# EAGLE schematic PCB Design 2 v94 (EAGLE 9.7.0)
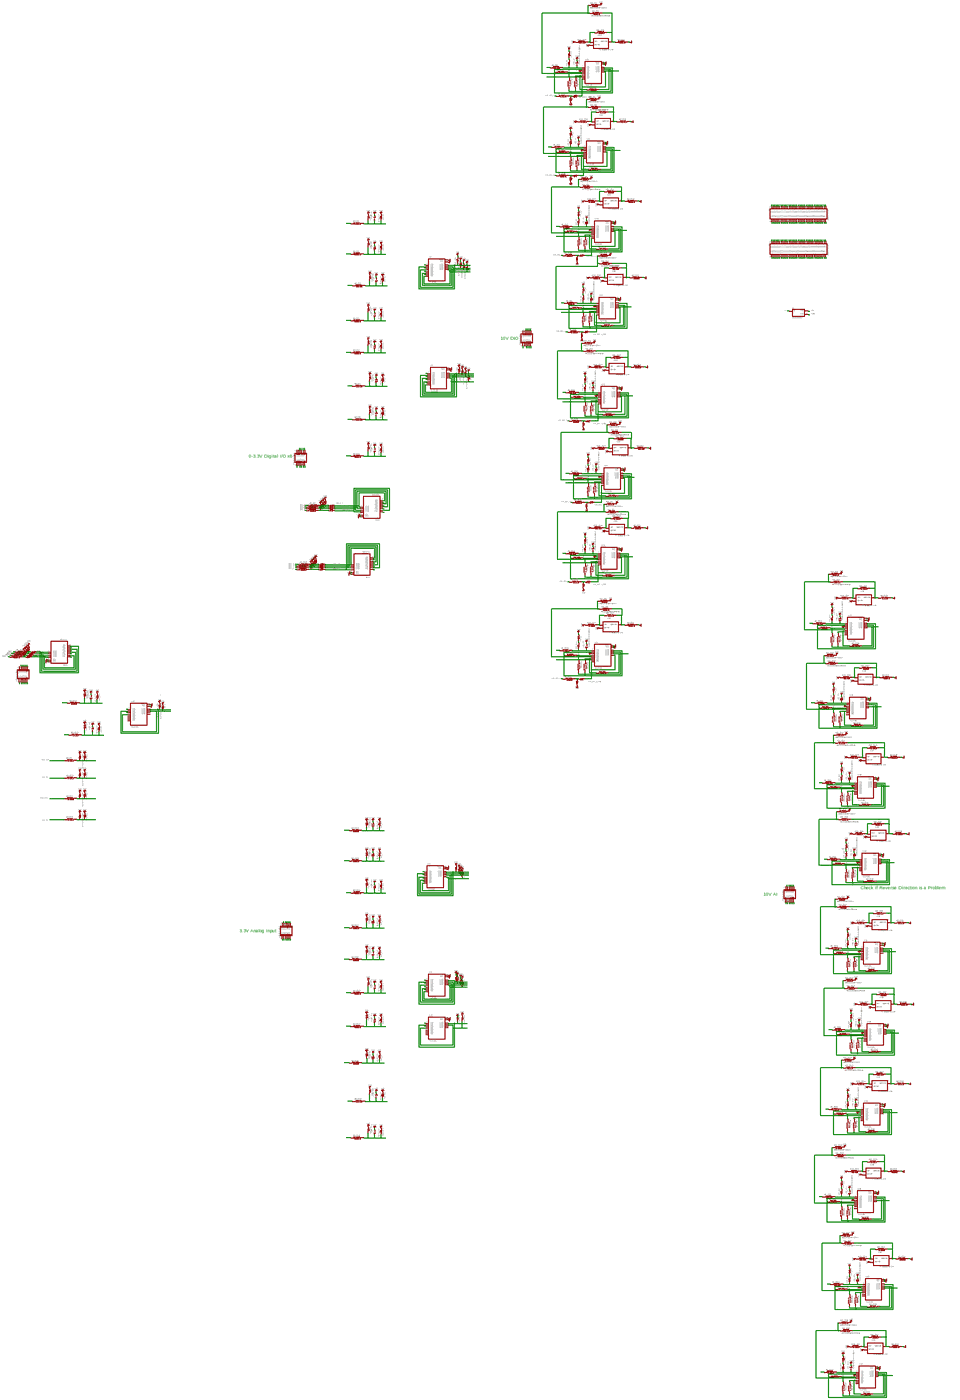
[diagram p0: schematic, sheet 1, overview]
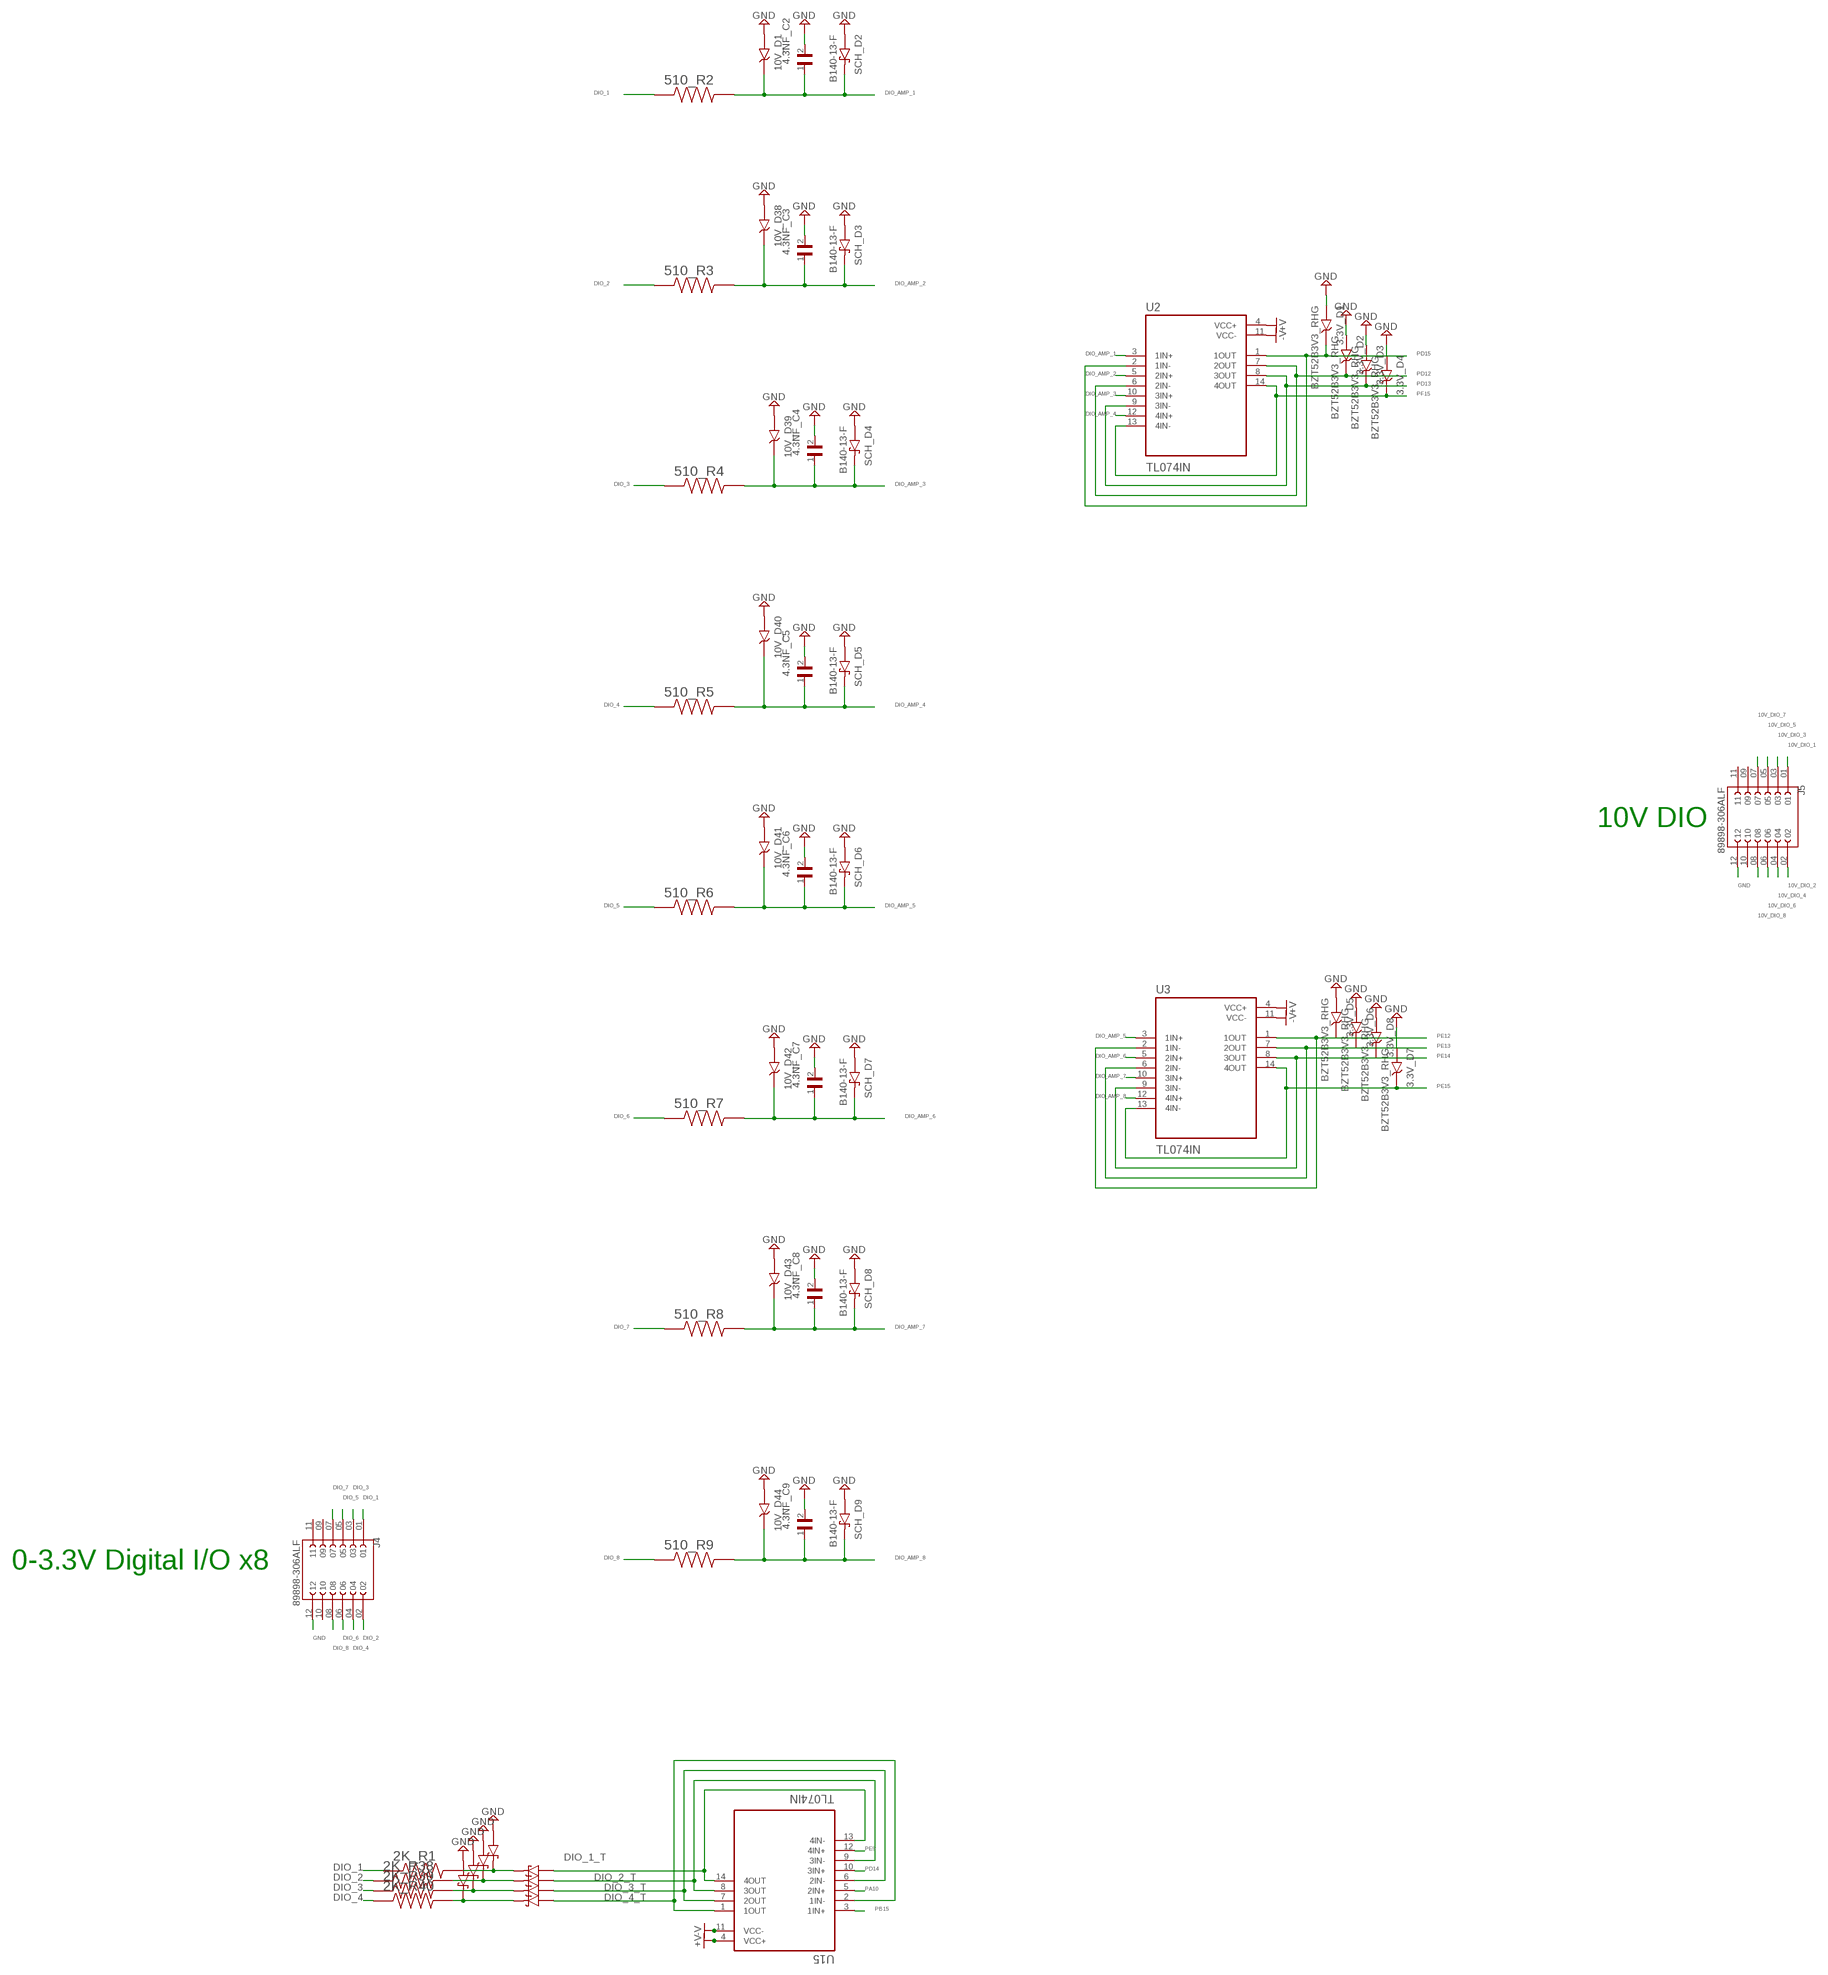
[diagram p1: schematic, sheet 1, part 1 of 7]
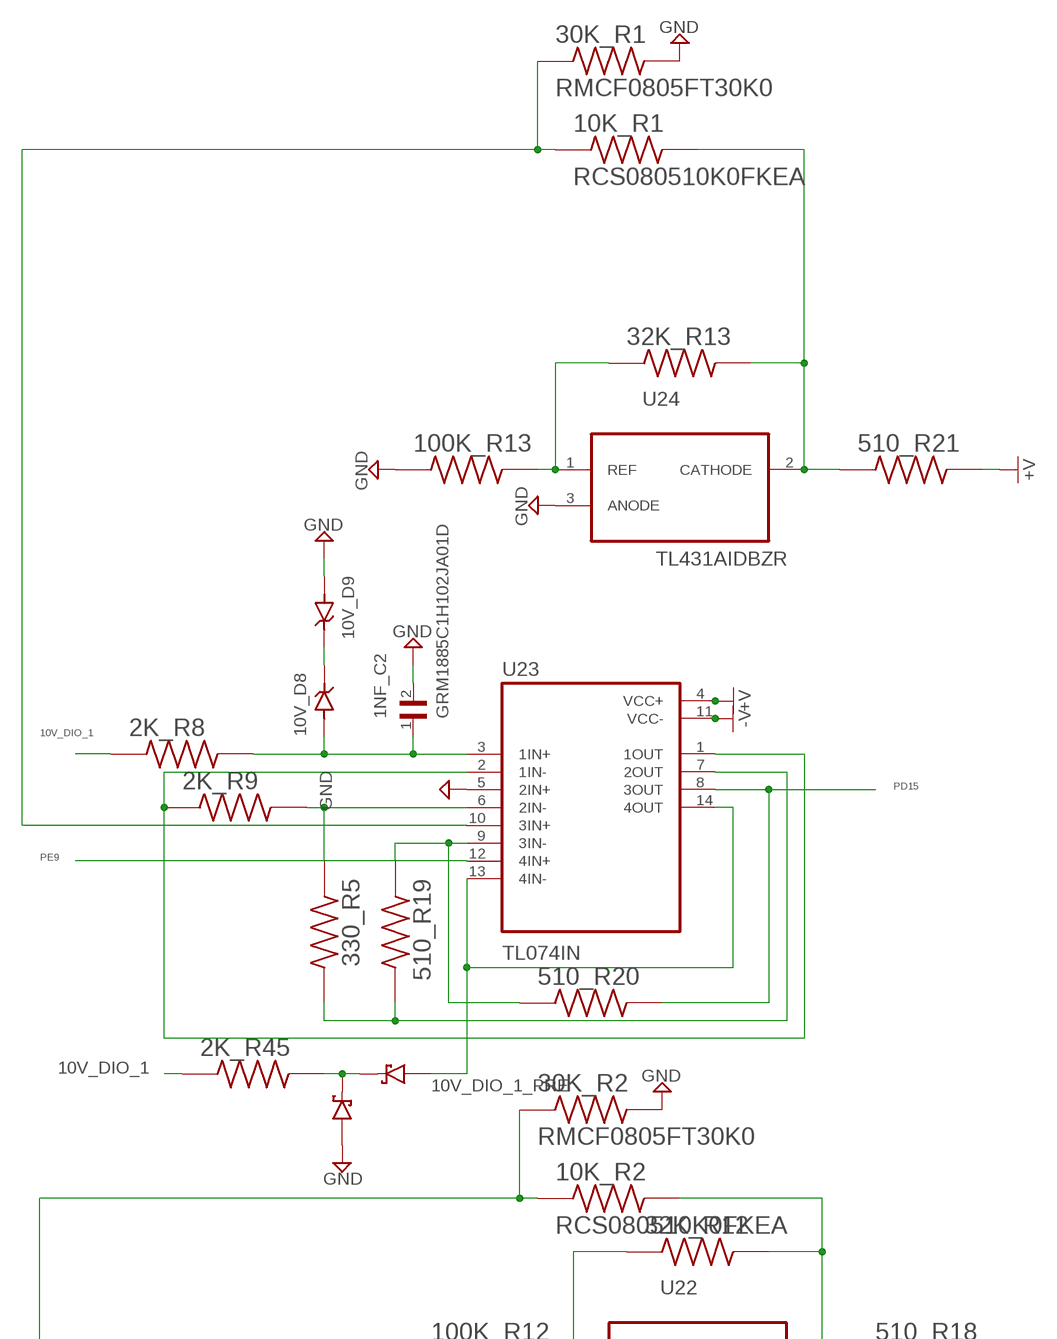
[diagram p2: schematic, sheet 1, part 2 of 7]
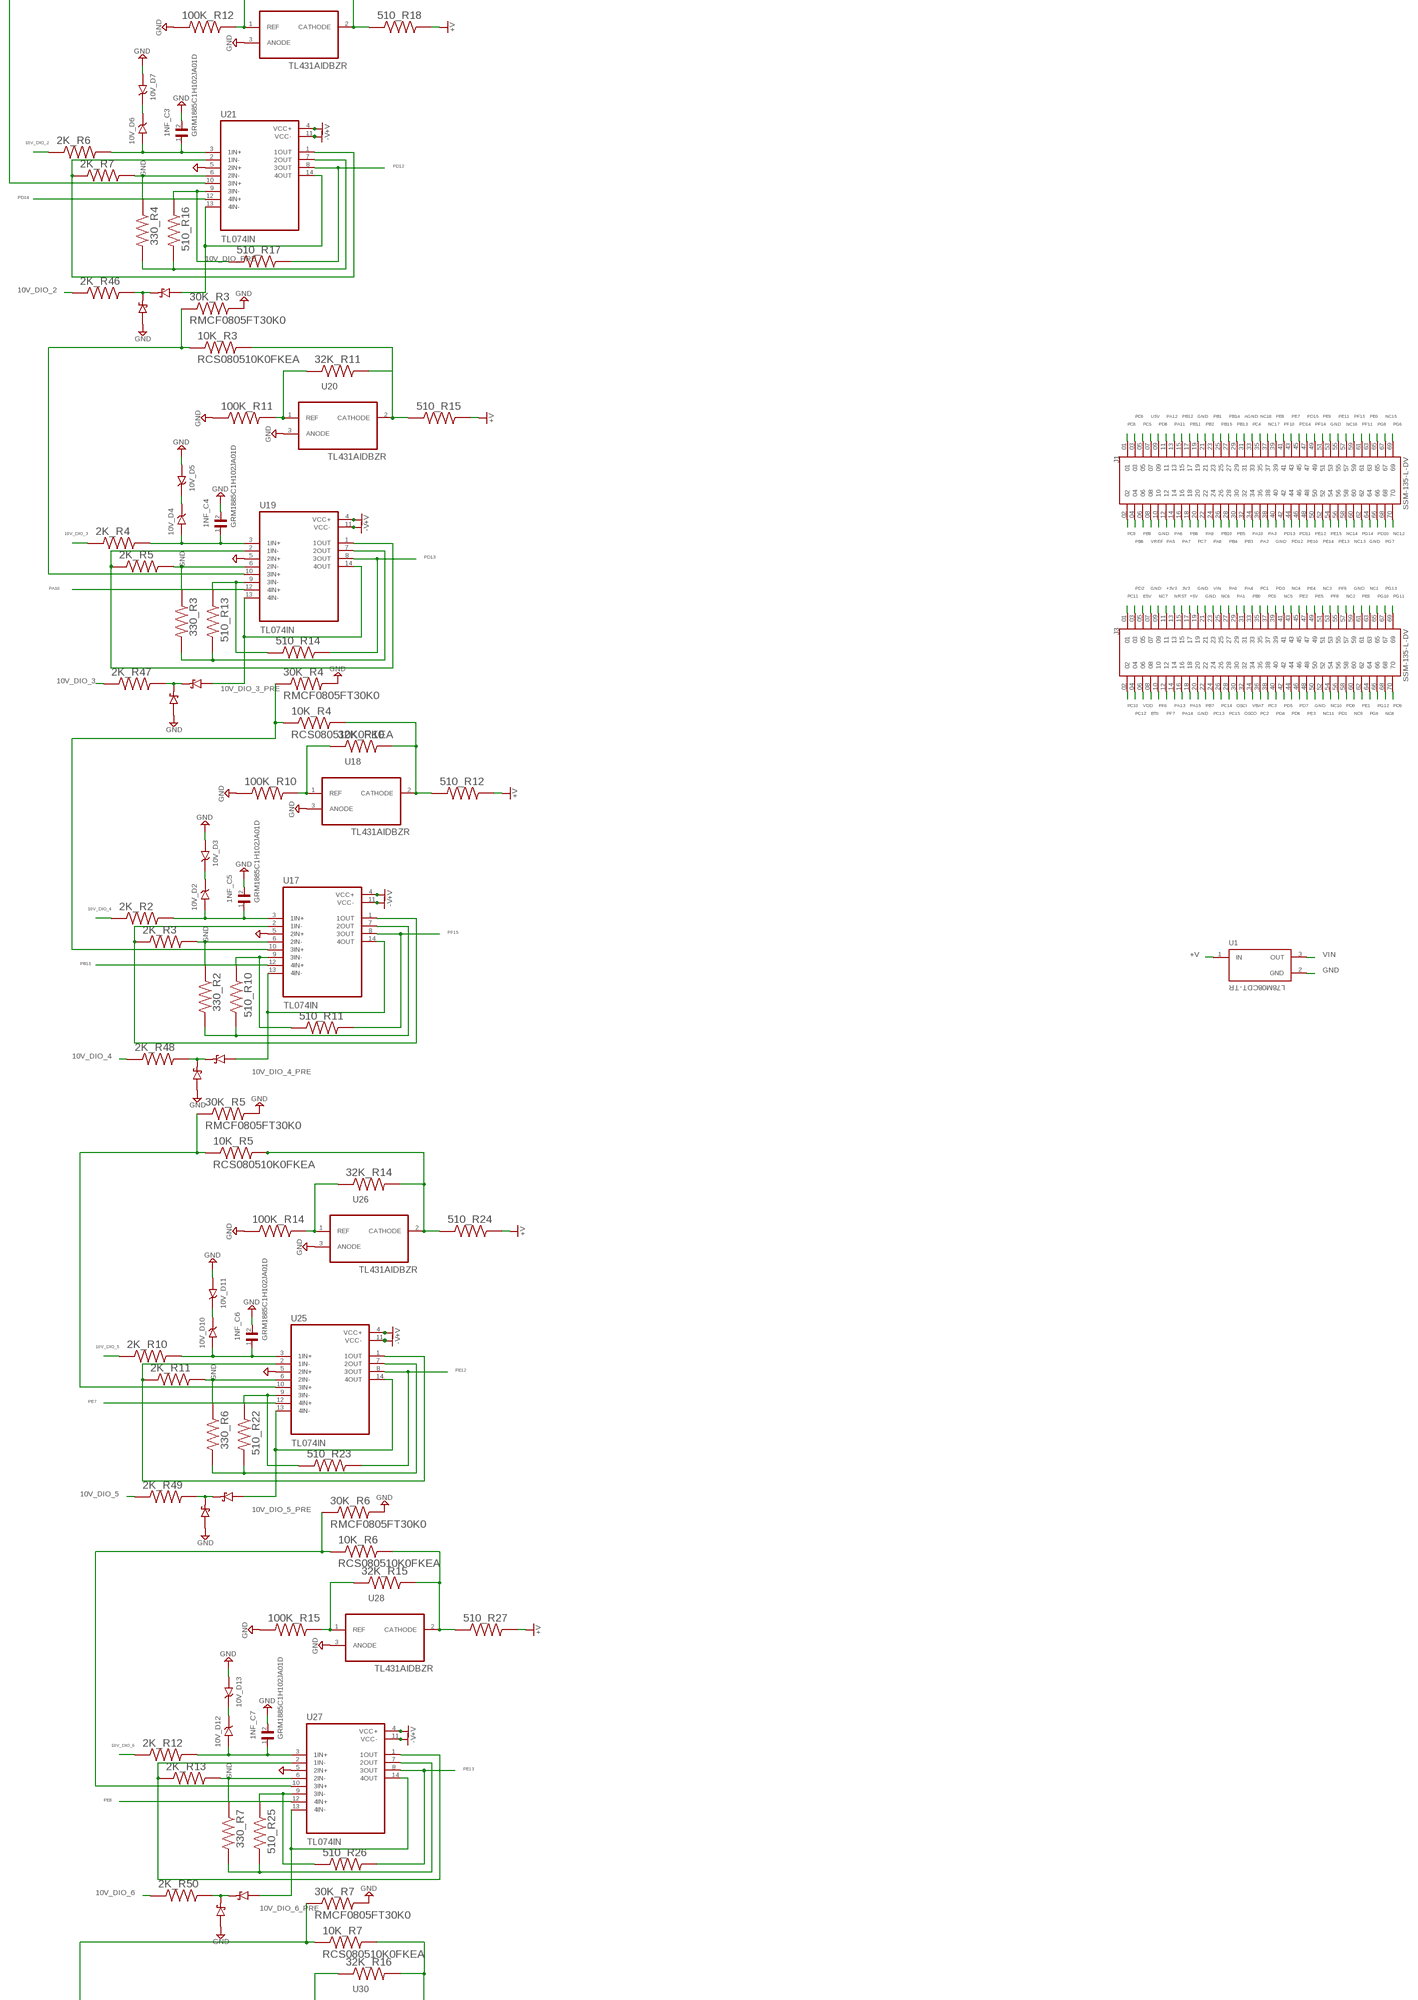
[diagram p3: schematic, sheet 1, part 3 of 7]
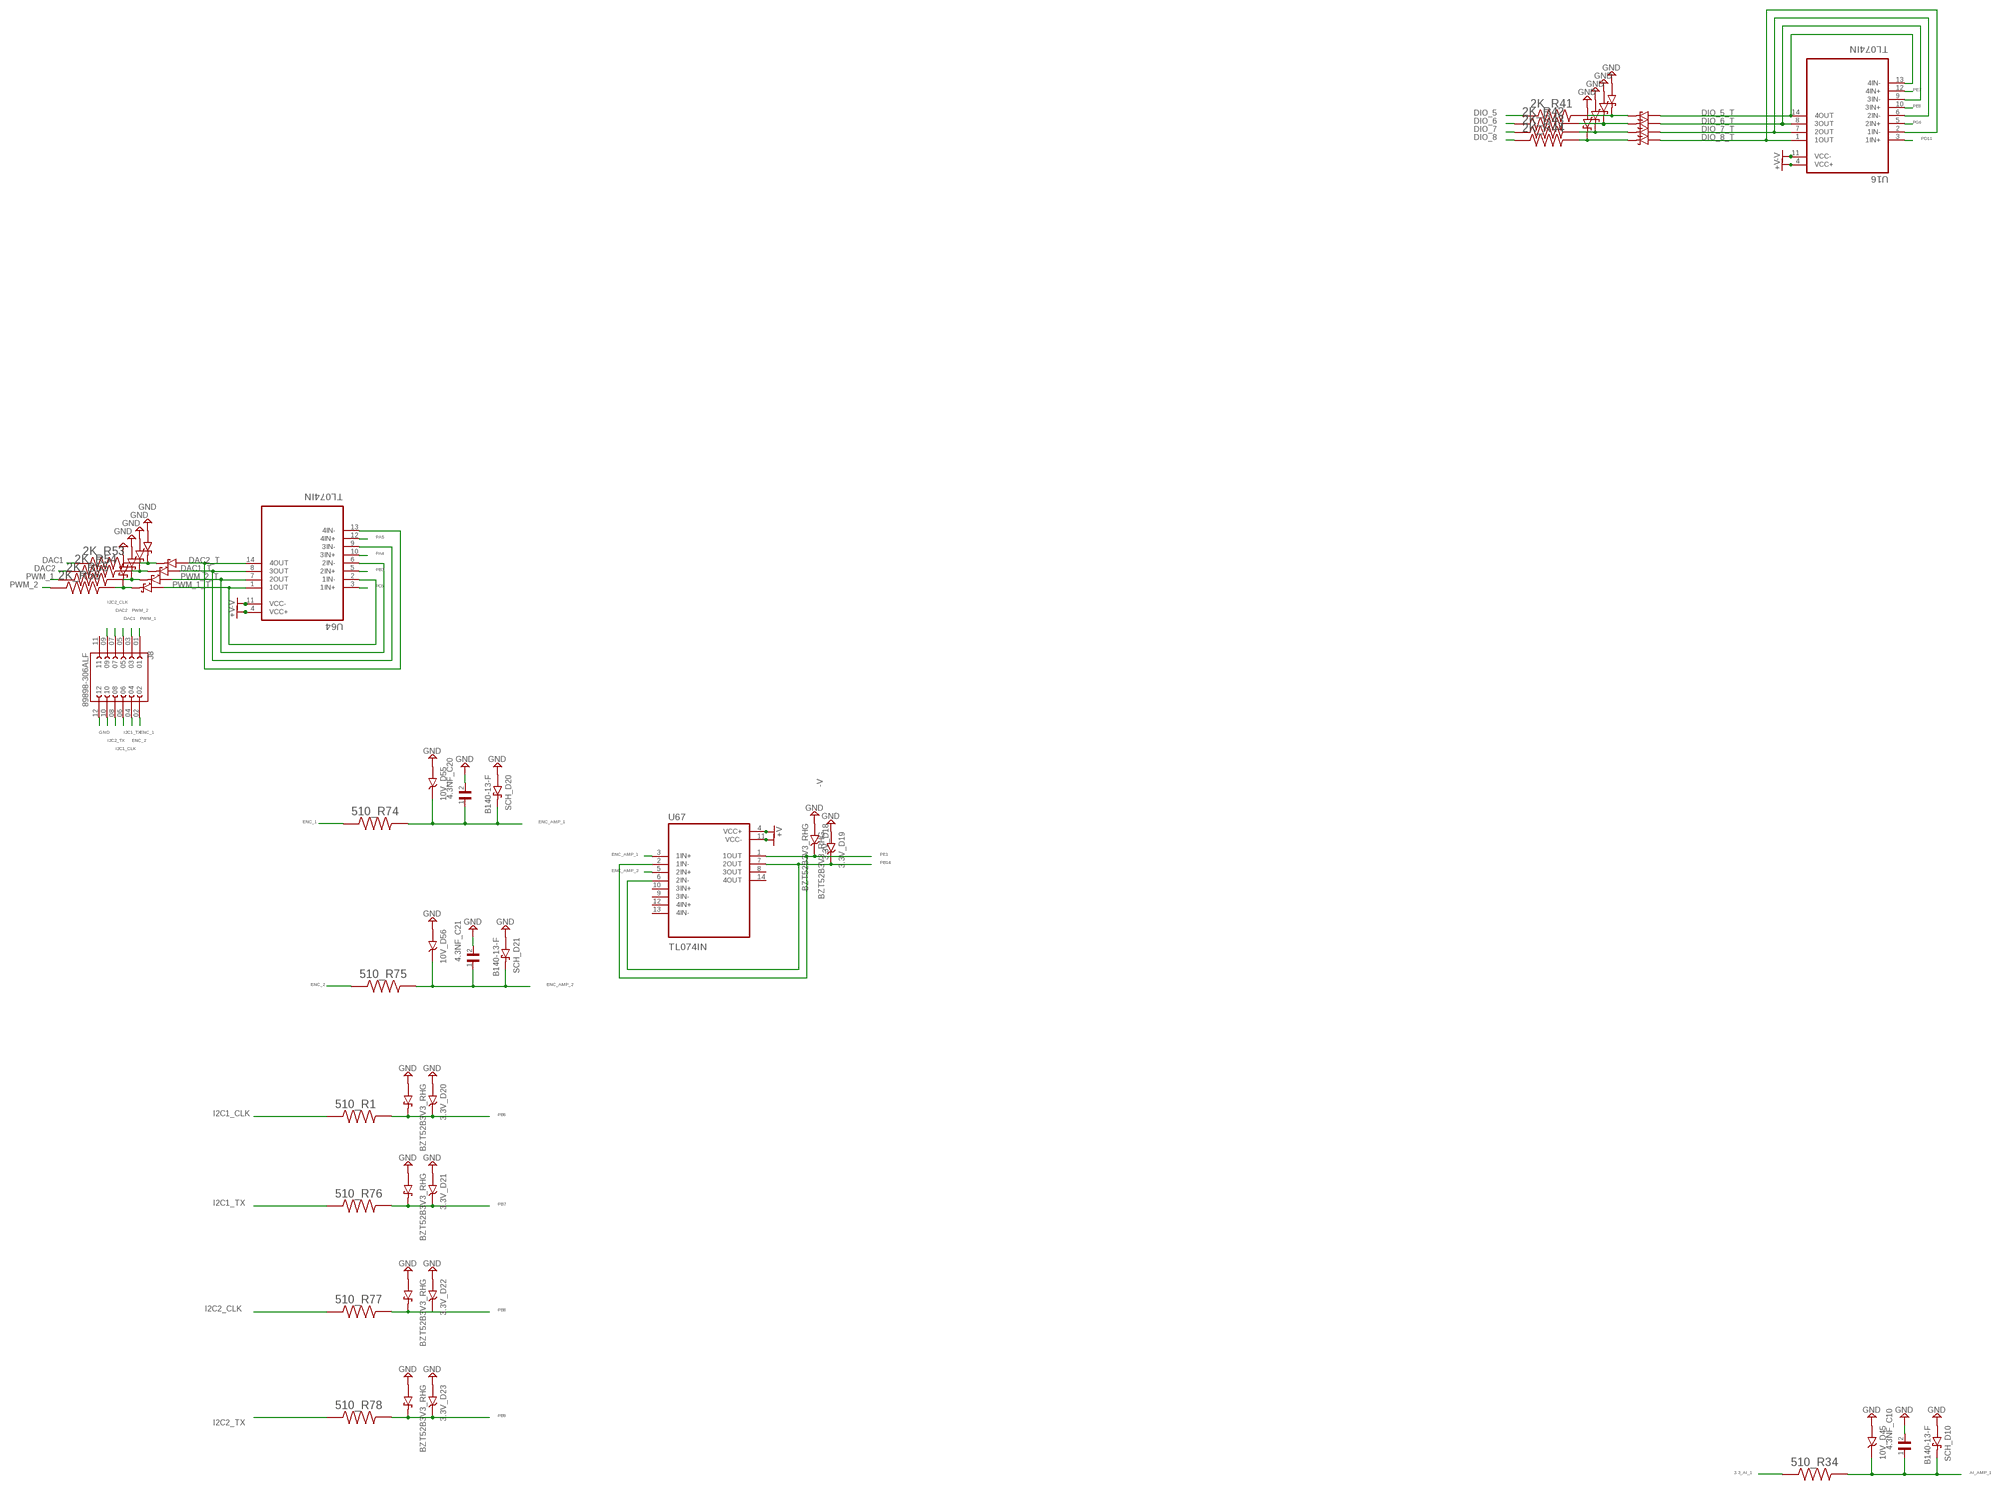
[diagram p4: schematic, sheet 1, part 4 of 7]
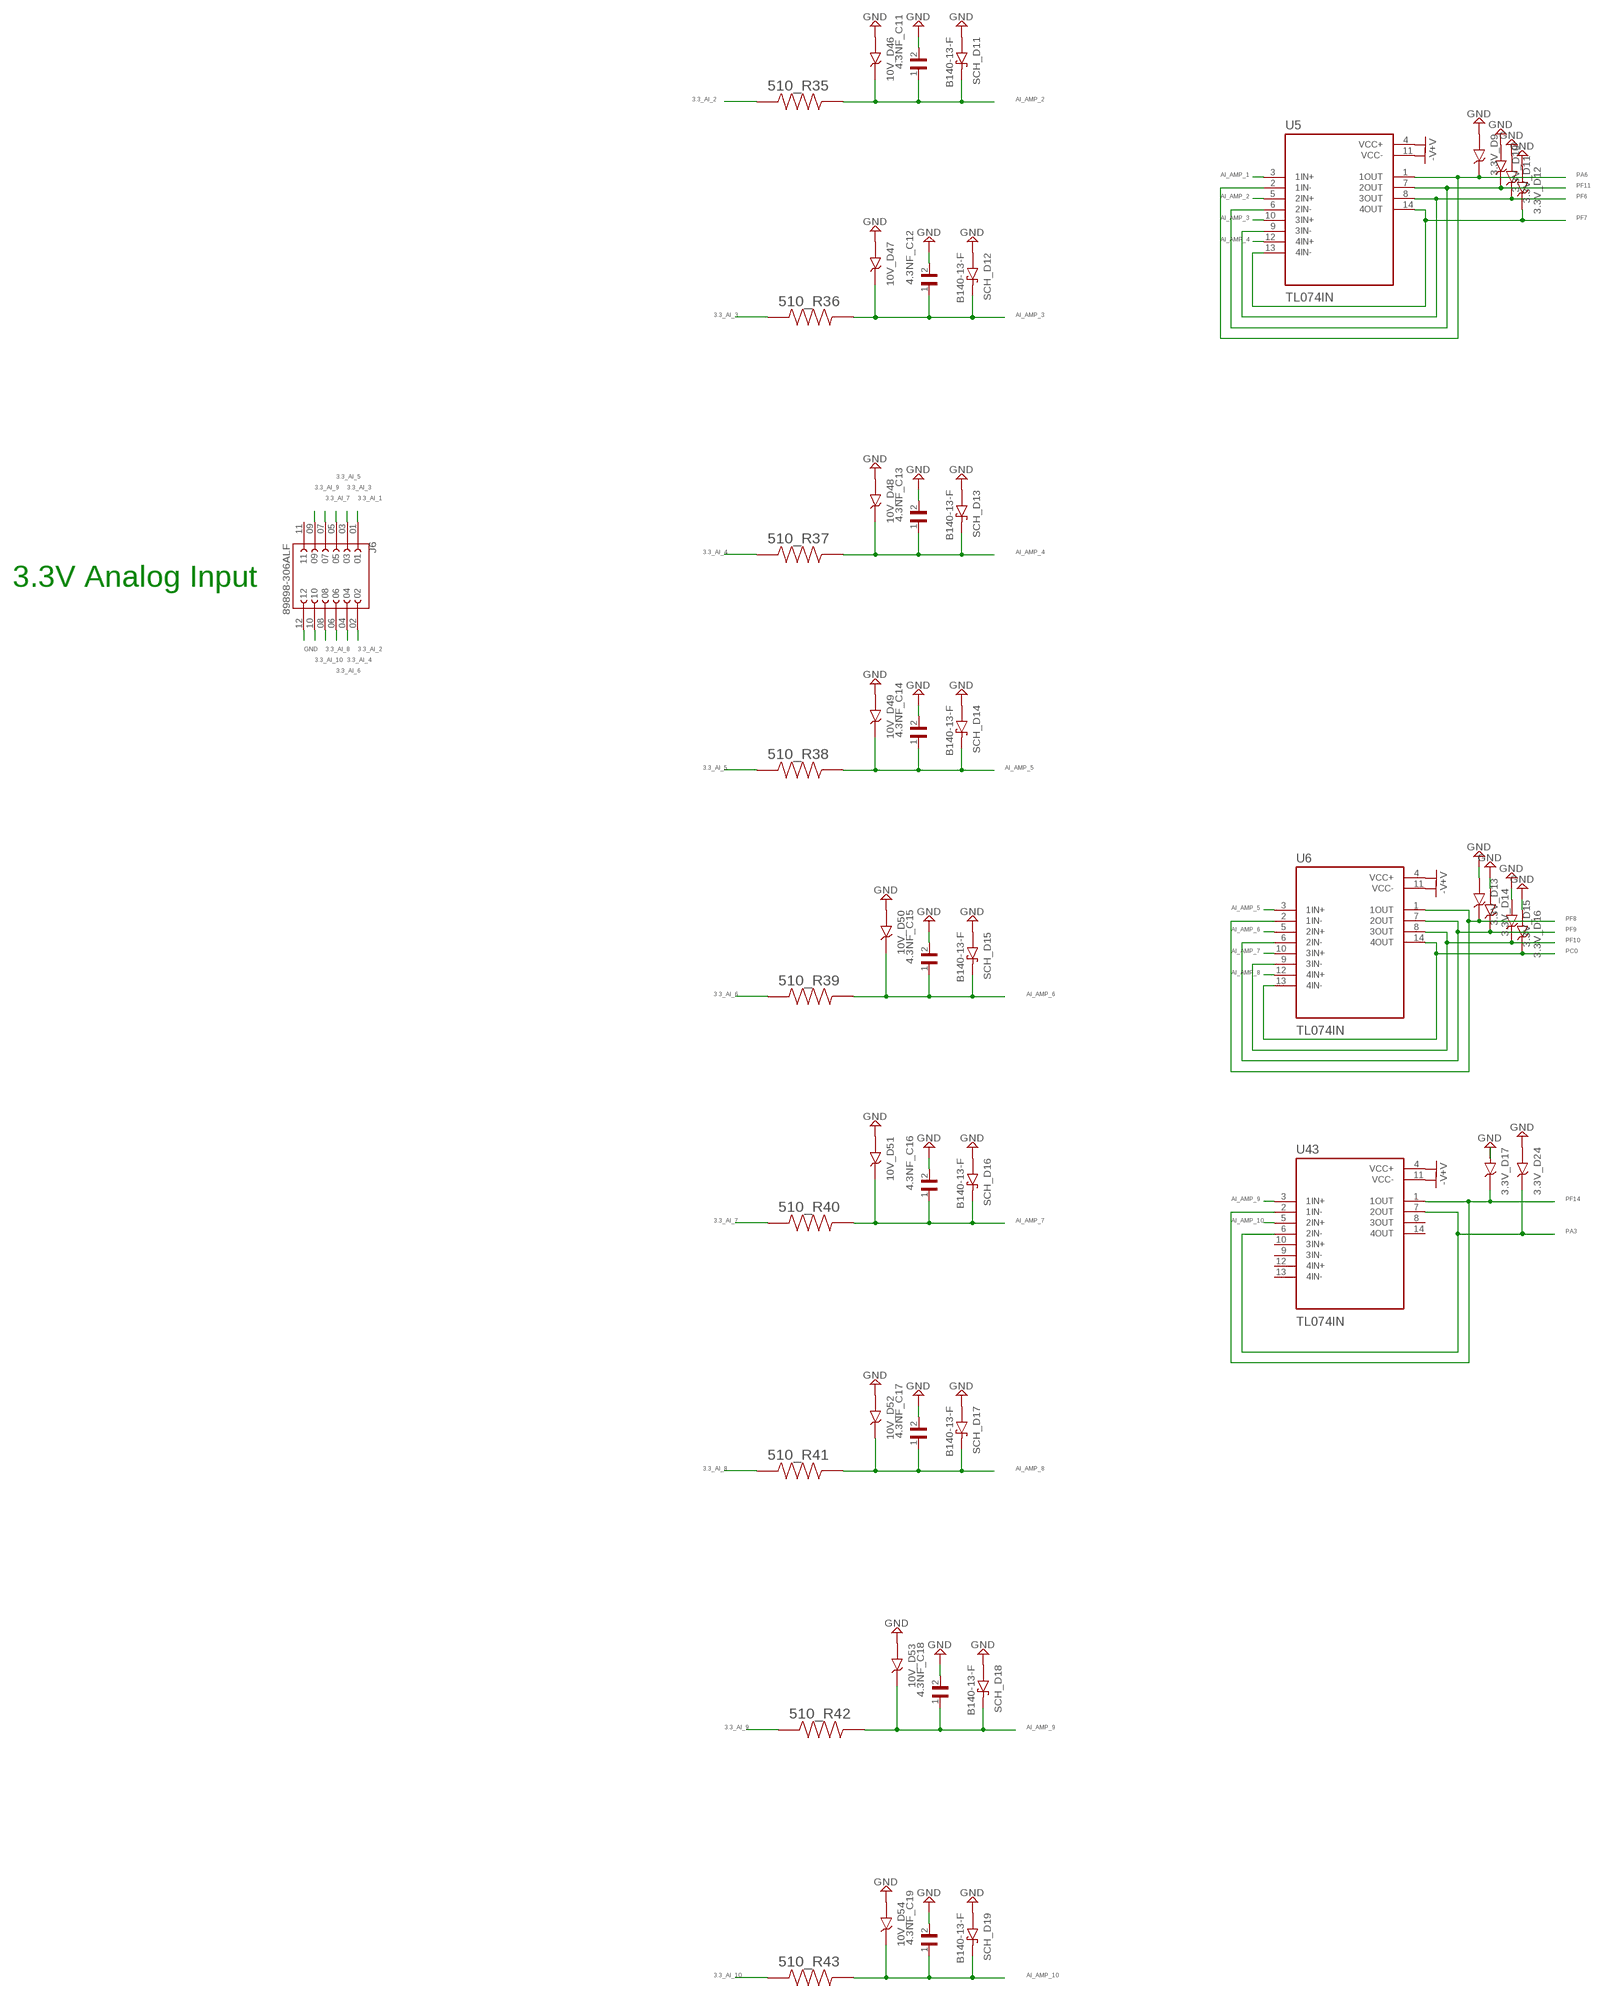
[diagram p5: schematic, sheet 1, part 5 of 7]
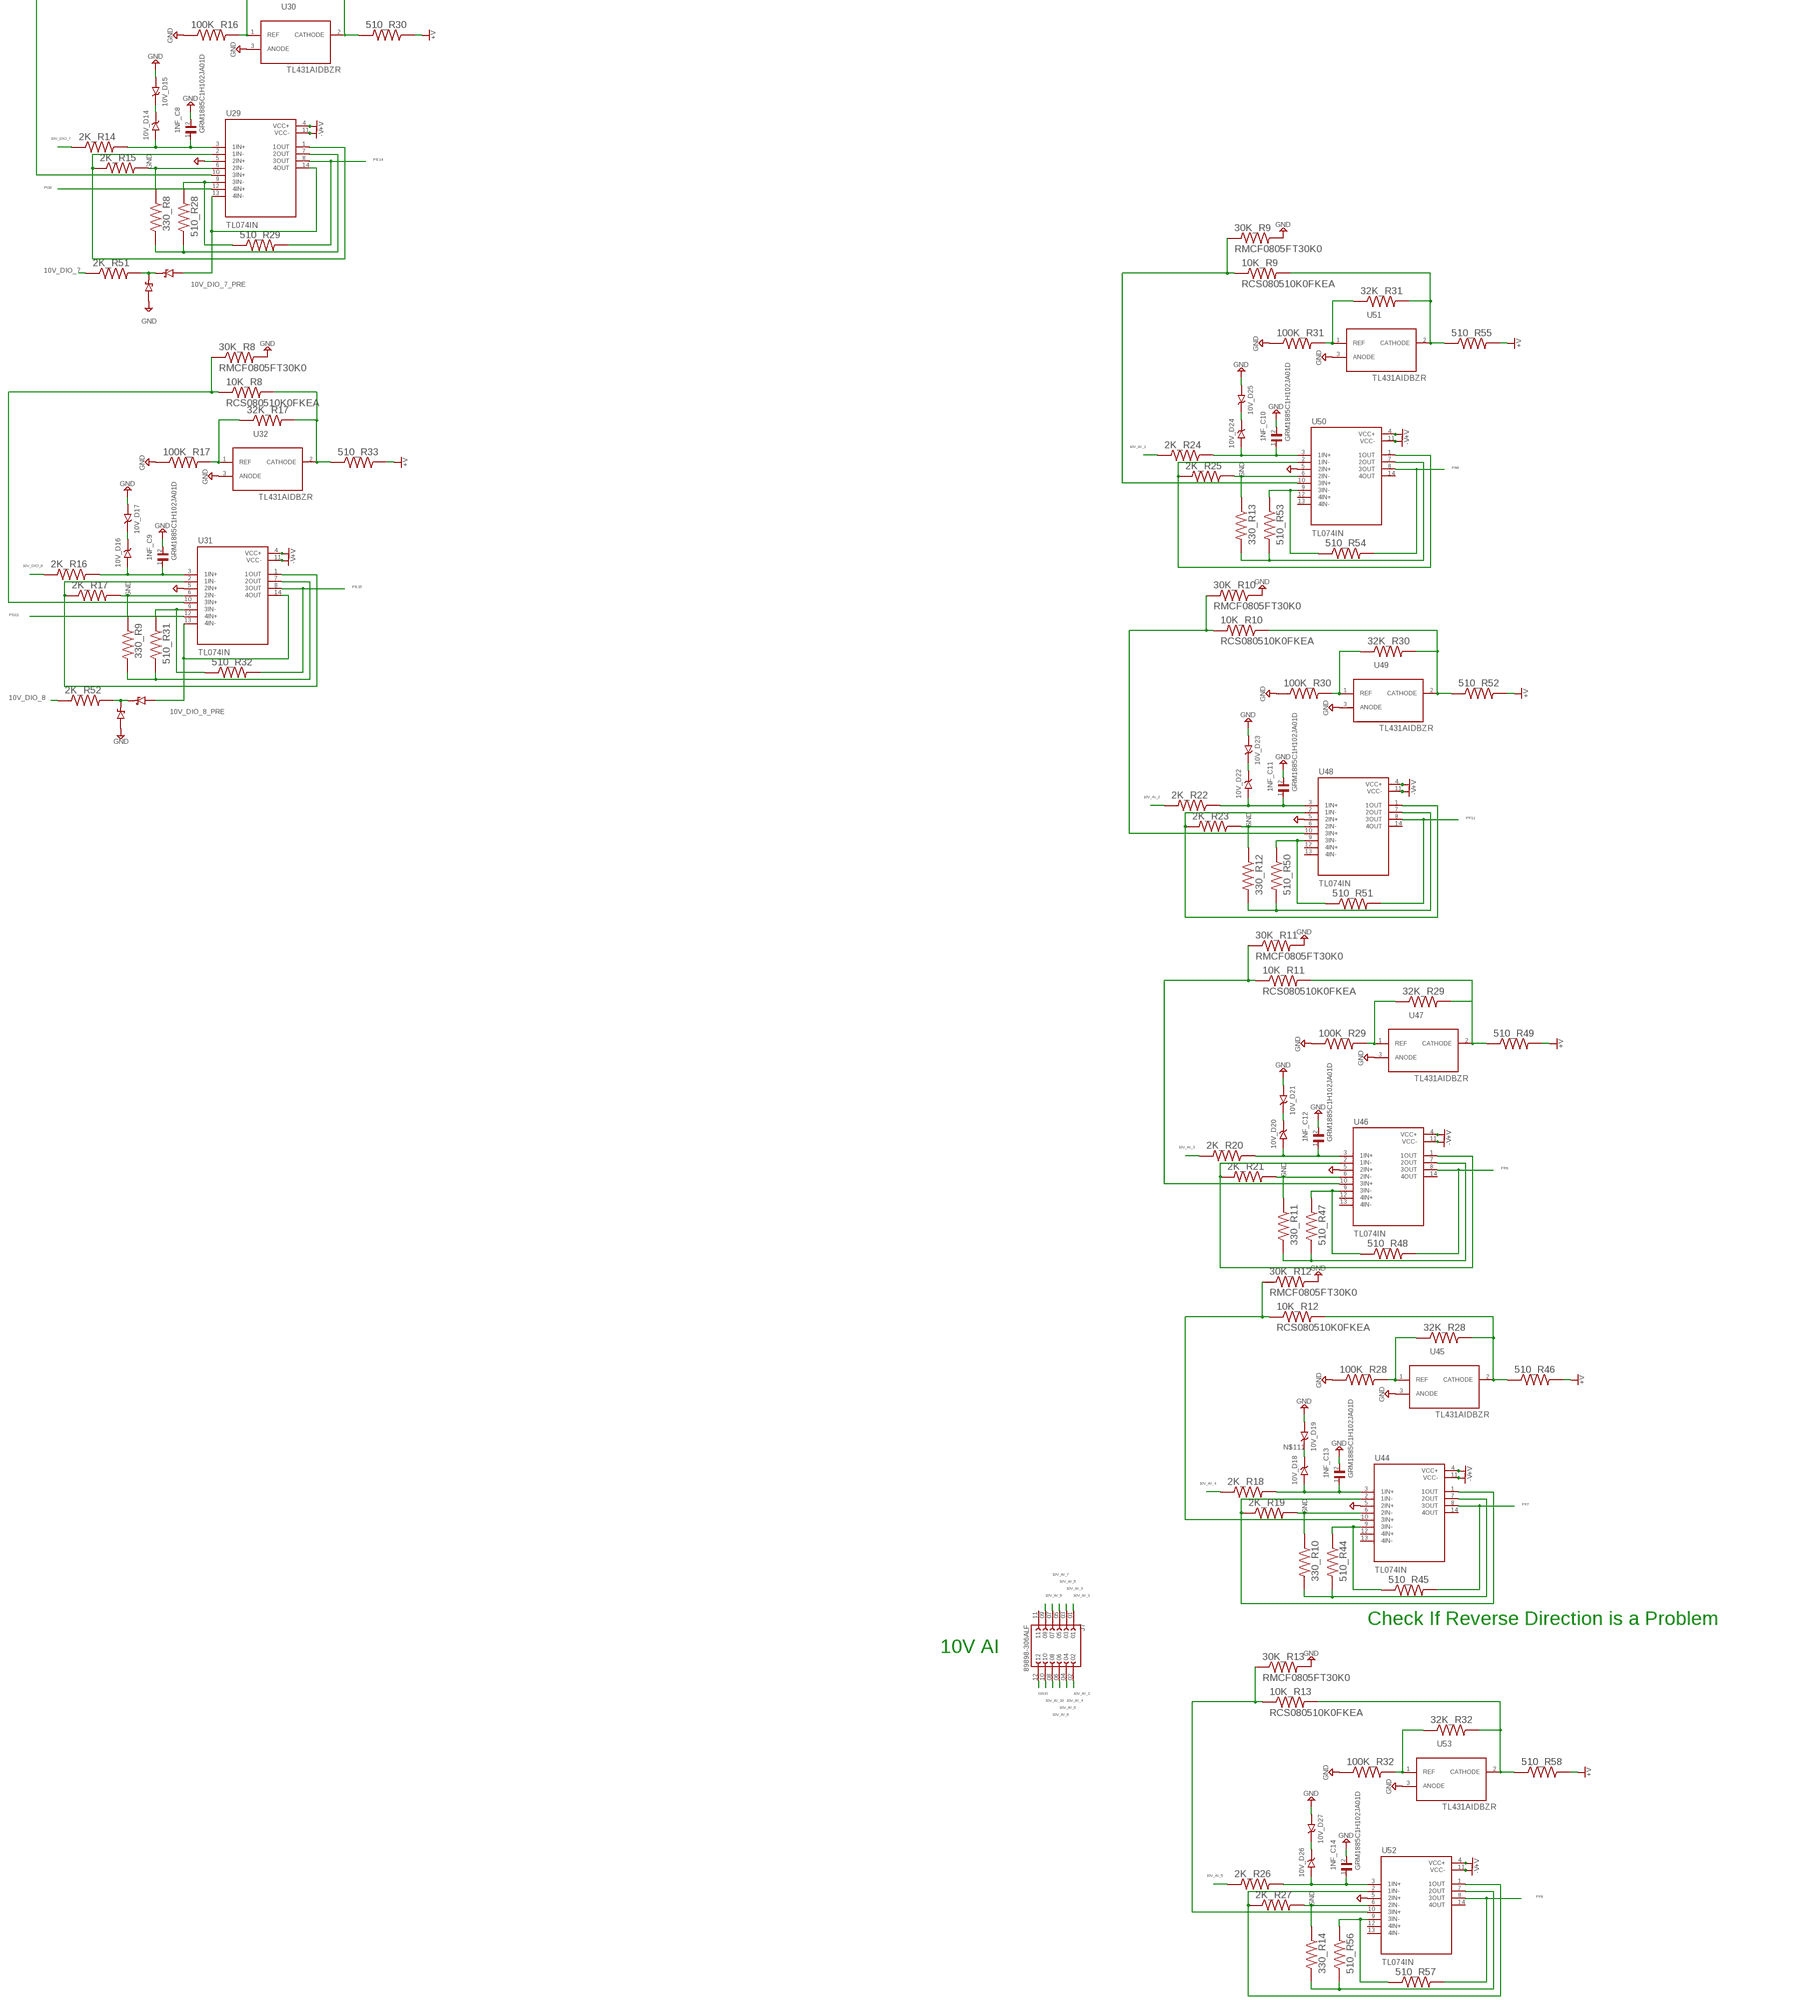
[diagram p6: schematic, sheet 1, part 6 of 7]
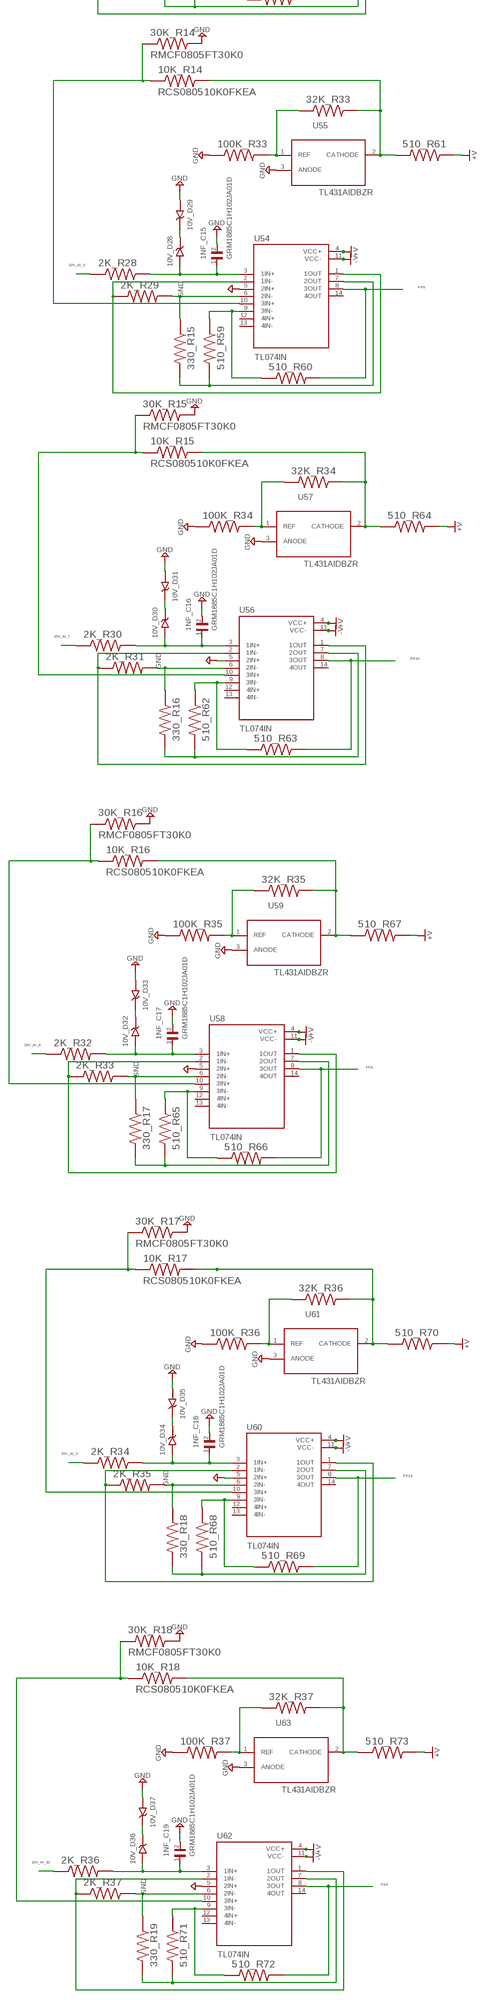
[diagram p7: schematic, sheet 1, part 7 of 7]

## Parts
1NF_C2  GRM1885C1H102JA01D  [CAPC1608X90N]
1NF_C3  GRM1885C1H102JA01D  [CAPC1608X90N]
1NF_C4  GRM1885C1H102JA01D  [CAPC1608X90N]
1NF_C5  GRM1885C1H102JA01D  [CAPC1608X90N]
1NF_C6  GRM1885C1H102JA01D  [CAPC1608X90N]
1NF_C7  GRM1885C1H102JA01D  [CAPC1608X90N]
1NF_C8  GRM1885C1H102JA01D  [CAPC1608X90N]
1NF_C9  GRM1885C1H102JA01D  [CAPC1608X90N]
1NF_C10  GRM1885C1H102JA01D  [CAPC1608X90N]
1NF_C11  GRM1885C1H102JA01D  [CAPC1608X90N]
1NF_C12  GRM1885C1H102JA01D  [CAPC1608X90N]
1NF_C13  GRM1885C1H102JA01D  [CAPC1608X90N]
1NF_C14  GRM1885C1H102JA01D  [CAPC1608X90N]
1NF_C15  GRM1885C1H102JA01D  [CAPC1608X90N]
1NF_C16  GRM1885C1H102JA01D  [CAPC1608X90N]
1NF_C17  GRM1885C1H102JA01D  [CAPC1608X90N]
1NF_C18  GRM1885C1H102JA01D  [CAPC1608X90N]
1NF_C19  GRM1885C1H102JA01D  [CAPC1608X90N]
2K_R1  RC2512FK-072KL  [RESC6331X65N]
2K_R2  RC2512FK-072KL  [RESC6331X65N]
2K_R3  RC2512FK-072KL  [RESC6331X65N]
2K_R4  RC2512FK-072KL  [RESC6331X65N]
2K_R5  RC2512FK-072KL  [RESC6331X65N]
2K_R6  RC2512FK-072KL  [RESC6331X65N]
2K_R7  RC2512FK-072KL  [RESC6331X65N]
2K_R8  RC2512FK-072KL  [RESC6331X65N]
2K_R9  RC2512FK-072KL  [RESC6331X65N]
2K_R10  RC2512FK-072KL  [RESC6331X65N]
2K_R11  RC2512FK-072KL  [RESC6331X65N]
2K_R12  RC2512FK-072KL  [RESC6331X65N]
2K_R13  RC2512FK-072KL  [RESC6331X65N]
2K_R14  RC2512FK-072KL  [RESC6331X65N]
2K_R15  RC2512FK-072KL  [RESC6331X65N]
2K_R16  RC2512FK-072KL  [RESC6331X65N]
2K_R17  RC2512FK-072KL  [RESC6331X65N]
2K_R18  RC2512FK-072KL  [RESC6331X65N]
2K_R19  RC2512FK-072KL  [RESC6331X65N]
2K_R20  RC2512FK-072KL  [RESC6331X65N]
2K_R21  RC2512FK-072KL  [RESC6331X65N]
2K_R22  RC2512FK-072KL  [RESC6331X65N]
2K_R23  RC2512FK-072KL  [RESC6331X65N]
2K_R24  RC2512FK-072KL  [RESC6331X65N]
2K_R25  RC2512FK-072KL  [RESC6331X65N]
2K_R26  RC2512FK-072KL  [RESC6331X65N]
2K_R27  RC2512FK-072KL  [RESC6331X65N]
2K_R28  RC2512FK-072KL  [RESC6331X65N]
2K_R29  RC2512FK-072KL  [RESC6331X65N]
2K_R30  RC2512FK-072KL  [RESC6331X65N]
2K_R31  RC2512FK-072KL  [RESC6331X65N]
2K_R32  RC2512FK-072KL  [RESC6331X65N]
2K_R33  RC2512FK-072KL  [RESC6331X65N]
2K_R34  RC2512FK-072KL  [RESC6331X65N]
2K_R35  RC2512FK-072KL  [RESC6331X65N]
2K_R36  RC2512FK-072KL  [RESC6331X65N]
2K_R37  RC2512FK-072KL  [RESC6331X65N]
2K_R38  RC2512FK-072KL  [RESC6331X65N]
2K_R39  RC2512FK-072KL  [RESC6331X65N]
2K_R40  RC2512FK-072KL  [RESC6331X65N]
2K_R41  RC2512FK-072KL  [RESC6331X65N]
2K_R42  RC2512FK-072KL  [RESC6331X65N]
2K_R43  RC2512FK-072KL  [RESC6331X65N]
2K_R44  RC2512FK-072KL  [RESC6331X65N]
2K_R45  RC2512FK-072KL  [RESC6331X65N]
2K_R46  RC2512FK-072KL  [RESC6331X65N]
2K_R47  RC2512FK-072KL  [RESC6331X65N]
2K_R48  RC2512FK-072KL  [RESC6331X65N]
2K_R49  RC2512FK-072KL  [RESC6331X65N]
2K_R50  RC2512FK-072KL  [RESC6331X65N]
2K_R51  RC2512FK-072KL  [RESC6331X65N]
2K_R52  RC2512FK-072KL  [RESC6331X65N]
2K_R53  RC2512FK-072KL  [RESC6331X65N]
2K_R54  RC2512FK-072KL  [RESC6331X65N]
2K_R55  RC2512FK-072KL  [RESC6331X65N]
2K_R56  RC2512FK-072KL  [RESC6331X65N]
3.3V_D1  BZT52B3V3_RHG  [DIO_BZT52B3V3_RHG]
3.3V_D2  BZT52B3V3_RHG  [DIO_BZT52B3V3_RHG]
3.3V_D3  BZT52B3V3_RHG  [DIO_BZT52B3V3_RHG]
3.3V_D4  BZT52B3V3_RHG  [DIO_BZT52B3V3_RHG]
3.3V_D5  BZT52B3V3_RHG  [DIO_BZT52B3V3_RHG]
3.3V_D6  BZT52B3V3_RHG  [DIO_BZT52B3V3_RHG]
3.3V_D7  BZT52B3V3_RHG  [DIO_BZT52B3V3_RHG]
3.3V_D8  BZT52B3V3_RHG  [DIO_BZT52B3V3_RHG]
3.3V_D9  BZT52B3V3_RHG  [DIO_BZT52B3V3_RHG]
3.3V_D10  BZT52B3V3_RHG  [DIO_BZT52B3V3_RHG]
3.3V_D11  BZT52B3V3_RHG  [DIO_BZT52B3V3_RHG]
3.3V_D12  BZT52B3V3_RHG  [DIO_BZT52B3V3_RHG]
3.3V_D13  BZT52B3V3_RHG  [DIO_BZT52B3V3_RHG]
3.3V_D14  BZT52B3V3_RHG  [DIO_BZT52B3V3_RHG]
3.3V_D15  BZT52B3V3_RHG  [DIO_BZT52B3V3_RHG]
3.3V_D16  BZT52B3V3_RHG  [DIO_BZT52B3V3_RHG]
3.3V_D17  BZT52B3V3_RHG  [DIO_BZT52B3V3_RHG]
3.3V_D18  BZT52B3V3_RHG  [DIO_BZT52B3V3_RHG]
3.3V_D19  BZT52B3V3_RHG  [DIO_BZT52B3V3_RHG]
3.3V_D20  BZT52B3V3_RHG  [DIO_BZT52B3V3_RHG]
3.3V_D21  BZT52B3V3_RHG  [DIO_BZT52B3V3_RHG]
3.3V_D22  BZT52B3V3_RHG  [DIO_BZT52B3V3_RHG]
3.3V_D23  BZT52B3V3_RHG  [DIO_BZT52B3V3_RHG]
3.3V_D24  BZT52B3V3_RHG  [DIO_BZT52B3V3_RHG]
4.3NF_C2  GRM1885C1H432JA01D  [CAPC1608X90N]
4.3NF_C3  GRM1885C1H432JA01D  [CAPC1608X90N]
4.3NF_C4  GRM1885C1H432JA01D  [CAPC1608X90N]
4.3NF_C5  GRM1885C1H432JA01D  [CAPC1608X90N]
4.3NF_C6  GRM1885C1H432JA01D  [CAPC1608X90N]
4.3NF_C7  GRM1885C1H432JA01D  [CAPC1608X90N]
4.3NF_C8  GRM1885C1H432JA01D  [CAPC1608X90N]
4.3NF_C9  GRM1885C1H432JA01D  [CAPC1608X90N]
4.3NF_C10  GRM1885C1H432JA01D  [CAPC1608X90N]
4.3NF_C11  GRM1885C1H432JA01D  [CAPC1608X90N]
4.3NF_C12  GRM1885C1H432JA01D  [CAPC1608X90N]
4.3NF_C13  GRM1885C1H432JA01D  [CAPC1608X90N]
4.3NF_C14  GRM1885C1H432JA01D  [CAPC1608X90N]
4.3NF_C15  GRM1885C1H432JA01D  [CAPC1608X90N]
4.3NF_C16  GRM1885C1H432JA01D  [CAPC1608X90N]
4.3NF_C17  GRM1885C1H432JA01D  [CAPC1608X90N]
4.3NF_C18  GRM1885C1H432JA01D  [CAPC1608X90N]
4.3NF_C19  GRM1885C1H432JA01D  [CAPC1608X90N]
4.3NF_C20  GRM1885C1H432JA01D  [CAPC1608X90N]
4.3NF_C21  GRM1885C1H432JA01D  [CAPC1608X90N]
10K_R1  RCS080510K0FKEA  [RESC2012X50N]
10K_R2  RCS080510K0FKEA  [RESC2012X50N]
10K_R3  RCS080510K0FKEA  [RESC2012X50N]
10K_R4  RCS080510K0FKEA  [RESC2012X50N]
10K_R5  RCS080510K0FKEA  [RESC2012X50N]
10K_R6  RCS080510K0FKEA  [RESC2012X50N]
10K_R7  RCS080510K0FKEA  [RESC2012X50N]
10K_R8  RCS080510K0FKEA  [RESC2012X50N]
10K_R9  RCS080510K0FKEA  [RESC2012X50N]
10K_R10  RCS080510K0FKEA  [RESC2012X50N]
10K_R11  RCS080510K0FKEA  [RESC2012X50N]
10K_R12  RCS080510K0FKEA  [RESC2012X50N]
10K_R13  RCS080510K0FKEA  [RESC2012X50N]
10K_R14  RCS080510K0FKEA  [RESC2012X50N]
10K_R15  RCS080510K0FKEA  [RESC2012X50N]
10K_R16  RCS080510K0FKEA  [RESC2012X50N]
10K_R17  RCS080510K0FKEA  [RESC2012X50N]
10K_R18  RCS080510K0FKEA  [RESC2012X50N]
10V_D1  SMAZ10-13-F  [DIOM5226X240N]
10V_D2  SMAZ10-13-F  [DIOM5226X240N]
10V_D3  SMAZ10-13-F  [DIOM5226X240N]
10V_D4  SMAZ10-13-F  [DIOM5226X240N]
10V_D5  SMAZ10-13-F  [DIOM5226X240N]
10V_D6  SMAZ10-13-F  [DIOM5226X240N]
10V_D7  SMAZ10-13-F  [DIOM5226X240N]
10V_D8  SMAZ10-13-F  [DIOM5226X240N]
10V_D9  SMAZ10-13-F  [DIOM5226X240N]
10V_D10  SMAZ10-13-F  [DIOM5226X240N]
10V_D11  SMAZ10-13-F  [DIOM5226X240N]
10V_D12  SMAZ10-13-F  [DIOM5226X240N]
10V_D13  SMAZ10-13-F  [DIOM5226X240N]
10V_D14  SMAZ10-13-F  [DIOM5226X240N]
10V_D15  SMAZ10-13-F  [DIOM5226X240N]
10V_D16  SMAZ10-13-F  [DIOM5226X240N]
10V_D17  SMAZ10-13-F  [DIOM5226X240N]
10V_D18  SMAZ10-13-F  [DIOM5226X240N]
10V_D19  SMAZ10-13-F  [DIOM5226X240N]
10V_D20  SMAZ10-13-F  [DIOM5226X240N]
10V_D21  SMAZ10-13-F  [DIOM5226X240N]
10V_D22  SMAZ10-13-F  [DIOM5226X240N]
10V_D23  SMAZ10-13-F  [DIOM5226X240N]
10V_D24  SMAZ10-13-F  [DIOM5226X240N]
10V_D25  SMAZ10-13-F  [DIOM5226X240N]
10V_D26  SMAZ10-13-F  [DIOM5226X240N]
10V_D27  SMAZ10-13-F  [DIOM5226X240N]
10V_D28  SMAZ10-13-F  [DIOM5226X240N]
10V_D29  SMAZ10-13-F  [DIOM5226X240N]
10V_D30  SMAZ10-13-F  [DIOM5226X240N]
10V_D31  SMAZ10-13-F  [DIOM5226X240N]
10V_D32  SMAZ10-13-F  [DIOM5226X240N]
10V_D33  SMAZ10-13-F  [DIOM5226X240N]
10V_D34  SMAZ10-13-F  [DIOM5226X240N]
10V_D35  SMAZ10-13-F  [DIOM5226X240N]
10V_D36  SMAZ10-13-F  [DIOM5226X240N]
10V_D37  SMAZ10-13-F  [DIOM5226X240N]
10V_D38  SMAZ10-13-F  [DIOM5226X240N]
10V_D39  SMAZ10-13-F  [DIOM5226X240N]
10V_D40  SMAZ10-13-F  [DIOM5226X240N]
10V_D41  SMAZ10-13-F  [DIOM5226X240N]
10V_D42  SMAZ10-13-F  [DIOM5226X240N]
10V_D43  SMAZ10-13-F  [DIOM5226X240N]
10V_D44  SMAZ10-13-F  [DIOM5226X240N]
10V_D45  SMAZ10-13-F  [DIOM5226X240N]
10V_D46  SMAZ10-13-F  [DIOM5226X240N]
10V_D47  SMAZ10-13-F  [DIOM5226X240N]
10V_D48  SMAZ10-13-F  [DIOM5226X240N]
10V_D49  SMAZ10-13-F  [DIOM5226X240N]
10V_D50  SMAZ10-13-F  [DIOM5226X240N]
10V_D51  SMAZ10-13-F  [DIOM5226X240N]
10V_D52  SMAZ10-13-F  [DIOM5226X240N]
10V_D53  SMAZ10-13-F  [DIOM5226X240N]
10V_D54  SMAZ10-13-F  [DIOM5226X240N]
10V_D55  SMAZ10-13-F  [DIOM5226X240N]
10V_D56  SMAZ10-13-F  [DIOM5226X240N]
30K_R1  RMCF0805FT30K0  [RESC2012X65N]
30K_R2  RMCF0805FT30K0  [RESC2012X65N]
30K_R3  RMCF0805FT30K0  [RESC2012X65N]
30K_R4  RMCF0805FT30K0  [RESC2012X65N]
30K_R5  RMCF0805FT30K0  [RESC2012X65N]
30K_R6  RMCF0805FT30K0  [RESC2012X65N]
30K_R7  RMCF0805FT30K0  [RESC2012X65N]
30K_R8  RMCF0805FT30K0  [RESC2012X65N]
30K_R9  RMCF0805FT30K0  [RESC2012X65N]
30K_R10  RMCF0805FT30K0  [RESC2012X65N]
30K_R11  RMCF0805FT30K0  [RESC2012X65N]
30K_R12  RMCF0805FT30K0  [RESC2012X65N]
30K_R13  RMCF0805FT30K0  [RESC2012X65N]
30K_R14  RMCF0805FT30K0  [RESC2012X65N]
30K_R15  RMCF0805FT30K0  [RESC2012X65N]
30K_R16  RMCF0805FT30K0  [RESC2012X65N]
30K_R17  RMCF0805FT30K0  [RESC2012X65N]
30K_R18  RMCF0805FT30K0  [RESC2012X65N]
32K_R10  RNCF0603BTE32K0  [RESC1508X55N]
32K_R11  RNCF0603BTE32K0  [RESC1508X55N]
32K_R12  RNCF0603BTE32K0  [RESC1508X55N]
32K_R13  RNCF0603BTE32K0  [RESC1508X55N]
32K_R14  RNCF0603BTE32K0  [RESC1508X55N]
32K_R15  RNCF0603BTE32K0  [RESC1508X55N]
32K_R16  RNCF0603BTE32K0  [RESC1508X55N]
32K_R17  RNCF0603BTE32K0  [RESC1508X55N]
32K_R28  RNCF0603BTE32K0  [RESC1508X55N]
32K_R29  RNCF0603BTE32K0  [RESC1508X55N]
32K_R30  RNCF0603BTE32K0  [RESC1508X55N]
32K_R31  RNCF0603BTE32K0  [RESC1508X55N]
32K_R32  RNCF0603BTE32K0  [RESC1508X55N]
32K_R33  RNCF0603BTE32K0  [RESC1508X55N]
32K_R34  RNCF0603BTE32K0  [RESC1508X55N]
32K_R35  RNCF0603BTE32K0  [RESC1508X55N]
32K_R36  RNCF0603BTE32K0  [RESC1508X55N]
32K_R37  RNCF0603BTE32K0  [RESC1508X55N]
100K_R10  RC0805FR-07100KL  [RESC2012X60N]
100K_R11  RC0805FR-07100KL  [RESC2012X60N]
100K_R12  RC0805FR-07100KL  [RESC2012X60N]
100K_R13  RC0805FR-07100KL  [RESC2012X60N]
100K_R14  RC0805FR-07100KL  [RESC2012X60N]
100K_R15  RC0805FR-07100KL  [RESC2012X60N]
100K_R16  RC0805FR-07100KL  [RESC2012X60N]
100K_R17  RC0805FR-07100KL  [RESC2012X60N]
100K_R28  RC0805FR-07100KL  [RESC2012X60N]
100K_R29  RC0805FR-07100KL  [RESC2012X60N]
100K_R30  RC0805FR-07100KL  [RESC2012X60N]
100K_R31  RC0805FR-07100KL  [RESC2012X60N]
100K_R32  RC0805FR-07100KL  [RESC2012X60N]
100K_R33  RC0805FR-07100KL  [RESC2012X60N]
100K_R34  RC0805FR-07100KL  [RESC2012X60N]
100K_R35  RC0805FR-07100KL  [RESC2012X60N]
100K_R36  RC0805FR-07100KL  [RESC2012X60N]
100K_R37  RC0805FR-07100KL  [RESC2012X60N]
330_R2  RC1206FR-07330RL  [RESC3116X65N]
330_R3  RC1206FR-07330RL  [RESC3116X65N]
330_R4  RC1206FR-07330RL  [RESC3116X65N]
330_R5  RC1206FR-07330RL  [RESC3116X65N]
330_R6  RC1206FR-07330RL  [RESC3116X65N]
330_R7  RC1206FR-07330RL  [RESC3116X65N]
330_R8  RC1206FR-07330RL  [RESC3116X65N]
330_R9  RC1206FR-07330RL  [RESC3116X65N]
330_R10  RC1206FR-07330RL  [RESC3116X65N]
330_R11  RC1206FR-07330RL  [RESC3116X65N]
330_R12  RC1206FR-07330RL  [RESC3116X65N]
330_R13  RC1206FR-07330RL  [RESC3116X65N]
330_R14  RC1206FR-07330RL  [RESC3116X65N]
330_R15  RC1206FR-07330RL  [RESC3116X65N]
330_R16  RC1206FR-07330RL  [RESC3116X65N]
330_R17  RC1206FR-07330RL  [RESC3116X65N]
330_R18  RC1206FR-07330RL  [RESC3116X65N]
330_R19  RC1206FR-07330RL  [RESC3116X65N]
510_R1  RMCF2512FT510R  [RESC6332X70N]
510_R2  RMCF2512FT510R  [RESC6332X70N]
510_R3  RMCF2512FT510R  [RESC6332X70N]
510_R4  RMCF2512FT510R  [RESC6332X70N]
510_R5  RMCF2512FT510R  [RESC6332X70N]
510_R6  RMCF2512FT510R  [RESC6332X70N]
510_R7  RMCF2512FT510R  [RESC6332X70N]
510_R8  RMCF2512FT510R  [RESC6332X70N]
510_R9  RMCF2512FT510R  [RESC6332X70N]
510_R10  RMCF2512FT510R  [RESC6332X70N]
510_R11  RMCF2512FT510R  [RESC6332X70N]
510_R12  RMCF2512FT510R  [RESC6332X70N]
510_R13  RMCF2512FT510R  [RESC6332X70N]
510_R14  RMCF2512FT510R  [RESC6332X70N]
510_R15  RMCF2512FT510R  [RESC6332X70N]
510_R16  RMCF2512FT510R  [RESC6332X70N]
510_R17  RMCF2512FT510R  [RESC6332X70N]
510_R18  RMCF2512FT510R  [RESC6332X70N]
510_R19  RMCF2512FT510R  [RESC6332X70N]
510_R20  RMCF2512FT510R  [RESC6332X70N]
510_R21  RMCF2512FT510R  [RESC6332X70N]
510_R22  RMCF2512FT510R  [RESC6332X70N]
510_R23  RMCF2512FT510R  [RESC6332X70N]
510_R24  RMCF2512FT510R  [RESC6332X70N]
510_R25  RMCF2512FT510R  [RESC6332X70N]
510_R26  RMCF2512FT510R  [RESC6332X70N]
510_R27  RMCF2512FT510R  [RESC6332X70N]
510_R28  RMCF2512FT510R  [RESC6332X70N]
510_R29  RMCF2512FT510R  [RESC6332X70N]
510_R30  RMCF2512FT510R  [RESC6332X70N]
510_R31  RMCF2512FT510R  [RESC6332X70N]
510_R32  RMCF2512FT510R  [RESC6332X70N]
510_R33  RMCF2512FT510R  [RESC6332X70N]
510_R34  RMCF2512FT510R  [RESC6332X70N]
510_R35  RMCF2512FT510R  [RESC6332X70N]
510_R36  RMCF2512FT510R  [RESC6332X70N]
510_R37  RMCF2512FT510R  [RESC6332X70N]
510_R38  RMCF2512FT510R  [RESC6332X70N]
510_R39  RMCF2512FT510R  [RESC6332X70N]
510_R40  RMCF2512FT510R  [RESC6332X70N]
510_R41  RMCF2512FT510R  [RESC6332X70N]
510_R42  RMCF2512FT510R  [RESC6332X70N]
510_R43  RMCF2512FT510R  [RESC6332X70N]
510_R44  RMCF2512FT510R  [RESC6332X70N]
510_R45  RMCF2512FT510R  [RESC6332X70N]
510_R46  RMCF2512FT510R  [RESC6332X70N]
510_R47  RMCF2512FT510R  [RESC6332X70N]
510_R48  RMCF2512FT510R  [RESC6332X70N]
510_R49  RMCF2512FT510R  [RESC6332X70N]
510_R50  RMCF2512FT510R  [RESC6332X70N]
510_R51  RMCF2512FT510R  [RESC6332X70N]
510_R52  RMCF2512FT510R  [RESC6332X70N]
510_R53  RMCF2512FT510R  [RESC6332X70N]
510_R54  RMCF2512FT510R  [RESC6332X70N]
510_R55  RMCF2512FT510R  [RESC6332X70N]
510_R56  RMCF2512FT510R  [RESC6332X70N]
510_R57  RMCF2512FT510R  [RESC6332X70N]
510_R58  RMCF2512FT510R  [RESC6332X70N]
510_R59  RMCF2512FT510R  [RESC6332X70N]
510_R60  RMCF2512FT510R  [RESC6332X70N]
510_R61  RMCF2512FT510R  [RESC6332X70N]
510_R62  RMCF2512FT510R  [RESC6332X70N]
510_R63  RMCF2512FT510R  [RESC6332X70N]
510_R64  RMCF2512FT510R  [RESC6332X70N]
510_R65  RMCF2512FT510R  [RESC6332X70N]
510_R66  RMCF2512FT510R  [RESC6332X70N]
510_R67  RMCF2512FT510R  [RESC6332X70N]
510_R68  RMCF2512FT510R  [RESC6332X70N]
510_R69  RMCF2512FT510R  [RESC6332X70N]
510_R70  RMCF2512FT510R  [RESC6332X70N]
510_R71  RMCF2512FT510R  [RESC6332X70N]
510_R72  RMCF2512FT510R  [RESC6332X70N]
510_R73  RMCF2512FT510R  [RESC6332X70N]
510_R74  RMCF2512FT510R  [RESC6332X70N]
510_R75  RMCF2512FT510R  [RESC6332X70N]
510_R76  RMCF2512FT510R  [RESC6332X70N]
510_R77  RMCF2512FT510R  [RESC6332X70N]
510_R78  RMCF2512FT510R  [RESC6332X70N]
J1  SSM-135-L-DV  [SAMTEC_SSM-135-L-DV]
J3  SSM-135-L-DV  [SAMTEC_SSM-135-L-DV]
J4  89898-306ALF  [AMPHENOL_89898-306ALF]
J5  89898-306ALF  [AMPHENOL_89898-306ALF]
J6  89898-306ALF  [AMPHENOL_89898-306ALF]
J7  89898-306ALF  [AMPHENOL_89898-306ALF]
J8  89898-306ALF  [AMPHENOL_89898-306ALF]
SCH_D1  B140-13-F  [DIOM4326X240N]
SCH_D2  B140-13-F  [DIOM4326X240N]
SCH_D3  B140-13-F  [DIOM4326X240N]
SCH_D4  B140-13-F  [DIOM4326X240N]
SCH_D5  B140-13-F  [DIOM4326X240N]
SCH_D6  B140-13-F  [DIOM4326X240N]
SCH_D7  B140-13-F  [DIOM4326X240N]
SCH_D8  B140-13-F  [DIOM4326X240N]
SCH_D9  B140-13-F  [DIOM4326X240N]
SCH_D10  B140-13-F  [DIOM4326X240N]
SCH_D11  B140-13-F  [DIOM4326X240N]
SCH_D12  B140-13-F  [DIOM4326X240N]
SCH_D13  B140-13-F  [DIOM4326X240N]
SCH_D14  B140-13-F  [DIOM4326X240N]
SCH_D15  B140-13-F  [DIOM4326X240N]
SCH_D16  B140-13-F  [DIOM4326X240N]
SCH_D17  B140-13-F  [DIOM4326X240N]
SCH_D18  B140-13-F  [DIOM4326X240N]
SCH_D19  B140-13-F  [DIOM4326X240N]
SCH_D20  B140-13-F  [DIOM4326X240N]
SCH_D21  B140-13-F  [DIOM4326X240N]
SCH_D22  B140-13-F  [DIOM4326X240N]
SCH_D23  B140-13-F  [DIOM4326X240N]
SCH_D24  B140-13-F  [DIOM4326X240N]
SCH_D25  B140-13-F  [DIOM4326X240N]
SCH_D26  B140-13-F  [DIOM4326X240N]
SCH_D27  B140-13-F  [DIOM4326X240N]
SCH_D28  B140-13-F  [DIOM4326X240N]
SCH_D29  B140-13-F  [DIOM4326X240N]
SCH_D30  B140-13-F  [DIOM4326X240N]
SCH_D31  B140-13-F  [DIOM4326X240N]
SCH_D32  B140-13-F  [DIOM4326X240N]
SCH_D33  B140-13-F  [DIOM4326X240N]
SCH_D34  B140-13-F  [DIOM4326X240N]
SCH_D35  B140-13-F  [DIOM4326X240N]
SCH_D36  B140-13-F  [DIOM4326X240N]
SCH_D37  B140-13-F  [DIOM4326X240N]
SCH_D38  B140-13-F  [DIOM4326X240N]
SCH_D39  B140-13-F  [DIOM4326X240N]
SCH_D40  B140-13-F  [DIOM4326X240N]
SCH_D41  B140-13-F  [DIOM4326X240N]
SCH_D42  B140-13-F  [DIOM4326X240N]
SCH_D43  B140-13-F  [DIOM4326X240N]
SCH_D44  B140-13-F  [DIOM4326X240N]
SCH_D45  B140-13-F  [DIOM4326X240N]
SCH_D46  B140-13-F  [DIOM4326X240N]
SCH_D47  B140-13-F  [DIOM4326X240N]
SCH_D48  B140-13-F  [DIOM4326X240N]
SCH_D49  B140-13-F  [DIOM4326X240N]
SCH_D50  B140-13-F  [DIOM4326X240N]
SCH_D51  B140-13-F  [DIOM4326X240N]
SCH_D52  B140-13-F  [DIOM4326X240N]
SCH_D53  B140-13-F  [DIOM4326X240N]
SCH_D54  B140-13-F  [DIOM4326X240N]
SCH_D55  B140-13-F  [DIOM4326X240N]
SCH_D56  B140-13-F  [DIOM4326X240N]
SCH_D57  B140-13-F  [DIOM4326X240N]
SCH_D58  B140-13-F  [DIOM4326X240N]
SCH_D59  B140-13-F  [DIOM4326X240N]
SCH_D60  B140-13-F  [DIOM4326X240N]
SCH_D61  B140-13-F  [DIOM4326X240N]
SCH_D62  B140-13-F  [DIOM4326X240N]
SCH_D63  B140-13-F  [DIOM4326X240N]
SCH_D64  B140-13-F  [DIOM4326X240N]
U1  L78M08CDT-TR  [VREG_L78M08CDT-TR]
U2  TL074IN  [DIP794W45P254L1969H508Q14]
U3  TL074IN  [DIP794W45P254L1969H508Q14]
U5  TL074IN  [DIP794W45P254L1969H508Q14]
U6  TL074IN  [DIP794W45P254L1969H508Q14]
U15  TL074IN  [DIP794W45P254L1969H508Q14]
U16  TL074IN  [DIP794W45P254L1969H508Q14]
U17  TL074IN  [DIP794W45P254L1969H508Q14]
U18  TL431AIDBZR  [SOT95P237X112-3N]
U19  TL074IN  [DIP794W45P254L1969H508Q14]
U20  TL431AIDBZR  [SOT95P237X112-3N]
U21  TL074IN  [DIP794W45P254L1969H508Q14]
U22  TL431AIDBZR  [SOT95P237X112-3N]
U23  TL074IN  [DIP794W45P254L1969H508Q14]
U24  TL431AIDBZR  [SOT95P237X112-3N]
U25  TL074IN  [DIP794W45P254L1969H508Q14]
U26  TL431AIDBZR  [SOT95P237X112-3N]
U27  TL074IN  [DIP794W45P254L1969H508Q14]
U28  TL431AIDBZR  [SOT95P237X112-3N]
U29  TL074IN  [DIP794W45P254L1969H508Q14]
U30  TL431AIDBZR  [SOT95P237X112-3N]
U31  TL074IN  [DIP794W45P254L1969H508Q14]
U32  TL431AIDBZR  [SOT95P237X112-3N]
U43  TL074IN  [DIP794W45P254L1969H508Q14]
U44  TL074IN  [DIP794W45P254L1969H508Q14]
U45  TL431AIDBZR  [SOT95P237X112-3N]
U46  TL074IN  [DIP794W45P254L1969H508Q14]
U47  TL431AIDBZR  [SOT95P237X112-3N]
U48  TL074IN  [DIP794W45P254L1969H508Q14]
U49  TL431AIDBZR  [SOT95P237X112-3N]
U50  TL074IN  [DIP794W45P254L1969H508Q14]
U51  TL431AIDBZR  [SOT95P237X112-3N]
U52  TL074IN  [DIP794W45P254L1969H508Q14]
U53  TL431AIDBZR  [SOT95P237X112-3N]
U54  TL074IN  [DIP794W45P254L1969H508Q14]
U55  TL431AIDBZR  [SOT95P237X112-3N]
U56  TL074IN  [DIP794W45P254L1969H508Q14]
U57  TL431AIDBZR  [SOT95P237X112-3N]
U58  TL074IN  [DIP794W45P254L1969H508Q14]
U59  TL431AIDBZR  [SOT95P237X112-3N]
U60  TL074IN  [DIP794W45P254L1969H508Q14]
U61  TL431AIDBZR  [SOT95P237X112-3N]
U62  TL074IN  [DIP794W45P254L1969H508Q14]
U63  TL431AIDBZR  [SOT95P237X112-3N]
U64  TL074IN  [DIP794W45P254L1969H508Q14]
U67  TL074IN  [DIP794W45P254L1969H508Q14]

## Nets
3.3_AI_1: 510_R34.1 J6.01
3.3_AI_2: 510_R35.1 J6.02
3.3_AI_3: 510_R36.1 J6.03
3.3_AI_4: 510_R37.1 J6.04
3.3_AI_5: 510_R38.1 J6.05
3.3_AI_6: 510_R39.1 J6.06
3.3_AI_7: 510_R40.1 J6.07
3.3_AI_8: 510_R41.1 J6.08
3.3_AI_9: 510_R42.1 J6.09
3.3_AI_10: 510_R43.1 J6.10
3V3: J3.15
10V_AI_1: 2K_R24.1 J7.01
10V_AI_2: 2K_R22.1 J7.02
10V_AI_3: 2K_R20.1 J7.03
10V_AI_4: 2K_R18.1 J7.04
10V_AI_5: 2K_R26.1 J7.05
10V_AI_6: 2K_R28.1 J7.06
10V_AI_7: 2K_R30.1 J7.07
10V_AI_8: 2K_R32.1 J7.08
10V_AI_9: 2K_R34.1 J7.09
10V_AI_10: 2K_R36.1 J7.10
10V_DIO_1: 2K_R8.1 2K_R45.1 J5.01
10V_DIO_1_PRE: SCH_D39.A U23.13(4IN-) U23.14(4OUT)
10V_DIO_2: 2K_R6.1 2K_R46.1 J5.02
10V_DIO_3: 2K_R4.1 2K_R47.1 J5.03
10V_DIO_3_PRE: SCH_D43.A U19.13(4IN-) U19.14(4OUT)
10V_DIO_4: 2K_R2.1 2K_R48.1 J5.04
10V_DIO_4_PRE: SCH_D45.A U17.13(4IN-) U17.14(4OUT)
10V_DIO_5: 2K_R10.1 2K_R49.1 J5.05
10V_DIO_5_PRE: SCH_D47.A U25.13(4IN-) U25.14(4OUT)
10V_DIO_6: 2K_R12.1 2K_R50.1 J5.06
10V_DIO_6_PRE: SCH_D49.A U27.13(4IN-) U27.14(4OUT)
10V_DIO_7: 2K_R14.1 2K_R51.1 J5.07
10V_DIO_7_PRE: SCH_D51.A U29.13(4IN-) U29.14(4OUT)
10V_DIO_8: 2K_R16.1 2K_R52.1 J5.08
10V_DIO_8_PRE: SCH_D53.A U31.13(4IN-) U31.14(4OUT)
10V_DIO_PRE: SCH_D41.A U21.13(4IN-) U21.14(4OUT)
+3V3: J3.11
+5V: J3.17
+V: 510_R12.2 510_R15.2 510_R18.2 510_R21.2 510_R24.2 510_R27.2 510_R30.2 510_R33.2 510_R46.2 510_R49.2 510_R52.2 510_R55.2 510_R58.2 510_R61.2 510_R64.2 510_R67.2 510_R70.2 510_R73.2 U1.1(IN) U2.4(VCC+) U3.4(VCC+) U5.4(VCC+) U6.4(VCC+) U15.4(VCC+) U16.4(VCC+) U17.4(VCC+) U19.4(VCC+) U21.4(VCC+) U23.4(VCC+) U25.4(VCC+) U27.4(VCC+) U29.4(VCC+) U31.4(VCC+) U43.4(VCC+) U44.4(VCC+) U46.4(VCC+) U48.4(VCC+) U50.4(VCC+) U52.4(VCC+) U54.4(VCC+) U56.4(VCC+) U58.4(VCC+) U60.4(VCC+) U62.4(VCC+) U64.4(VCC+) U67.4(VCC+)
-V: U2.11(VCC-) U3.11(VCC-) U5.11(VCC-) U6.11(VCC-) U15.11(VCC-) U16.11(VCC-) U17.11(VCC-) U19.11(VCC-) U21.11(VCC-) U23.11(VCC-) U25.11(VCC-) U27.11(VCC-) U29.11(VCC-) U31.11(VCC-) U43.11(VCC-) U44.11(VCC-) U46.11(VCC-) U48.11(VCC-) U50.11(VCC-) U52.11(VCC-) U54.11(VCC-) U56.11(VCC-) U58.11(VCC-) U60.11(VCC-) U62.11(VCC-) U64.11(VCC-) U67.11(VCC-)
AGND: J1.31
AI_AMP_1: 4.3NF_C10.1 10V_D45.1(K) 510_R34.2 SCH_D10.C(K) U5.3(1IN+)
AI_AMP_2: 4.3NF_C11.1 10V_D46.1(K) 510_R35.2 SCH_D11.C(K) U5.5(2IN+)
AI_AMP_3: 4.3NF_C12.1 10V_D47.1(K) 510_R36.2 SCH_D12.C(K) U5.10(3IN+)
AI_AMP_4: 4.3NF_C13.1 10V_D48.1(K) 510_R37.2 SCH_D13.C(K) U5.12(4IN+)
AI_AMP_5: 4.3NF_C14.1 10V_D49.1(K) 510_R38.2 SCH_D14.C(K) U6.3(1IN+)
AI_AMP_6: 4.3NF_C15.1 10V_D50.1(K) 510_R39.2 SCH_D15.C(K) U6.5(2IN+)
AI_AMP_7: 4.3NF_C16.1 10V_D51.1(K) 510_R40.2 SCH_D16.C(K) U6.10(3IN+)
AI_AMP_8: 4.3NF_C17.1 10V_D52.1(K) 510_R41.2 SCH_D17.C(K) U6.12(4IN+)
AI_AMP_9: 4.3NF_C18.1 10V_D53.1(K) 510_R42.2 SCH_D18.C(K) U43.3(1IN+)
AI_AMP_10: 4.3NF_C19.1 10V_D54.1(K) 510_R43.2 SCH_D19.C(K) U43.5(2IN+)
BT0: J3.08
DAC1: 2K_R53.1 J8.05
DAC1_T: SCH_D57.A U64.8(3OUT) U64.9(3IN-)
DAC2: 2K_R54.1 J8.07
DAC2_T: SCH_D55.A U64.13(4IN-) U64.14(4OUT)
DIO_1: 2K_R1.1 510_R2.1 J4.01
DIO_1_T: SCH_D1.A U15.13(4IN-) U15.14(4OUT)
DIO_2: 2K_R38.1 510_R3.1 J4.02
DIO_2_T: SCH_D24.A U15.8(3OUT) U15.9(3IN-)
DIO_3: 2K_R39.1 510_R4.1 J4.03
DIO_3_T: SCH_D25.A U15.6(2IN-) U15.7(2OUT)
DIO_4: 2K_R40.1 510_R5.1 J4.04
DIO_4_T: SCH_D26.A U15.1(1OUT) U15.2(1IN-)
DIO_5: 2K_R41.1 510_R6.1 J4.05
DIO_5_T: SCH_D31.A U16.13(4IN-) U16.14(4OUT)
DIO_6: 2K_R42.1 510_R7.1 J4.06
DIO_6_T: SCH_D32.A U16.8(3OUT) U16.9(3IN-)
DIO_7: 2K_R43.1 510_R8.1 J4.07
DIO_7_T: SCH_D33.A U16.6(2IN-) U16.7(2OUT)
DIO_8: 2K_R44.1 510_R9.1 J4.08
DIO_8_T: SCH_D34.A U16.1(1OUT) U16.2(1IN-)
DIO_AMP_1: 4.3NF_C2.1 10V_D1.1(K) 510_R2.2 SCH_D2.C(K) U2.3(1IN+)
DIO_AMP_2: 4.3NF_C3.1 10V_D38.1(K) 510_R3.2 SCH_D3.C(K) U2.5(2IN+)
DIO_AMP_3: 4.3NF_C4.1 10V_D39.1(K) 510_R4.2 SCH_D4.C(K) U2.10(3IN+)
DIO_AMP_4: 4.3NF_C5.1 10V_D40.1(K) 510_R5.2 SCH_D5.C(K) U2.12(4IN+)
DIO_AMP_5: 4.3NF_C6.1 10V_D41.1(K) 510_R6.2 SCH_D6.C(K) U3.3(1IN+)
DIO_AMP_6: 4.3NF_C7.1 10V_D42.1(K) 510_R7.2 SCH_D7.C(K) U3.5(2IN+)
DIO_AMP_7: 4.3NF_C8.1 10V_D43.1(K) 510_R8.2 SCH_D8.C(K) U3.10(3IN+)
DIO_AMP_8: 4.3NF_C9.1 10V_D44.1(K) 510_R9.2 SCH_D9.C(K) U3.12(4IN+)
E5V: J3.05
ENC_1: 510_R74.1 J8.02
ENC_2: 510_R75.1 J8.04
ENC_AMP_1: 4.3NF_C20.1 10V_D55.1(K) 510_R74.2 SCH_D20.C(K) U67.3(1IN+)
ENC_AMP_2: 4.3NF_C21.1 10V_D56.1(K) 510_R75.2 SCH_D21.C(K) U67.5(2IN+)
GND: 1NF_C2.2 1NF_C3.2 1NF_C4.2 1NF_C5.2 1NF_C6.2 1NF_C7.2 1NF_C8.2 1NF_C9.2 1NF_C10.2 1NF_C11.2 1NF_C12.2 1NF_C13.2 1NF_C14.2 1NF_C15.2 1NF_C16.2 1NF_C17.2 1NF_C18.2 1NF_C19.2 3.3V_D1.A 3.3V_D2.A 3.3V_D3.A 3.3V_D4.A 3.3V_D5.A 3.3V_D6.A 3.3V_D7.A 3.3V_D8.A 3.3V_D9.A 3.3V_D10.A 3.3V_D11.A 3.3V_D12.A 3.3V_D13.A 3.3V_D14.A 3.3V_D15.A 3.3V_D16.A 3.3V_D17.A 3.3V_D18.A 3.3V_D19.A 3.3V_D20.A 3.3V_D21.A 3.3V_D22.A 3.3V_D23.A 3.3V_D24.A 4.3NF_C2.2 4.3NF_C3.2 4.3NF_C4.2 4.3NF_C5.2 4.3NF_C6.2 4.3NF_C7.2 4.3NF_C8.2 4.3NF_C9.2 4.3NF_C10.2 4.3NF_C11.2 4.3NF_C12.2 4.3NF_C13.2 4.3NF_C14.2 4.3NF_C15.2 4.3NF_C16.2 4.3NF_C17.2 4.3NF_C18.2 4.3NF_C19.2 4.3NF_C20.2 4.3NF_C21.2 10V_D1.2(A) 10V_D3.2(A) 10V_D5.2(A) 10V_D7.2(A) 10V_D9.2(A) 10V_D11.2(A) 10V_D13.2(A) 10V_D15.2(A) 10V_D17.2(A) 10V_D19.2(A) 10V_D21.2(A) 10V_D23.2(A) 10V_D25.2(A) 10V_D27.2(A) 10V_D29.2(A) 10V_D31.2(A) 10V_D33.2(A) 10V_D35.2(A) 10V_D37.2(A) 10V_D38.2(A) 10V_D39.2(A) 10V_D40.2(A) 10V_D41.2(A) 10V_D42.2(A) 10V_D43.2(A) 10V_D44.2(A) 10V_D45.2(A) 10V_D46.2(A) 10V_D47.2(A) 10V_D48.2(A) 10V_D49.2(A) 10V_D50.2(A) 10V_D51.2(A) 10V_D52.2(A) 10V_D53.2(A) 10V_D54.2(A) 10V_D55.2(A) 10V_D56.2(A) 30K_R1.2 30K_R2.2 30K_R3.2 30K_R4.2 30K_R5.2 30K_R6.2 30K_R7.2 30K_R8.2 30K_R9.2 30K_R10.2 30K_R11.2 30K_R12.2 30K_R13.2 30K_R14.2 30K_R15.2 30K_R16.2 30K_R17.2 30K_R18.2 100K_R10.1 100K_R11.1 100K_R12.1 100K_R13.1 100K_R14.1 100K_R15.1 100K_R16.1 100K_R17.1 100K_R28.1 100K_R29.1 100K_R30.1 100K_R31.1 100K_R32.1 100K_R33.1 100K_R34.1 100K_R35.1 100K_R36.1 100K_R37.1 J1.10 J1.19 J1.40 J1.53 J1.64 J3.07 J3.19 J3.20 J3.21 J3.50 J3.59 J4.12 J5.12 J6.12 J7.12 J8.12 SCH_D2.A SCH_D3.A SCH_D4.A SCH_D5.A SCH_D6.A SCH_D7.A SCH_D8.A SCH_D9.A SCH_D10.A SCH_D11.A SCH_D12.A SCH_D13.A SCH_D14.A SCH_D15.A SCH_D16.A SCH_D17.A SCH_D18.A SCH_D19.A SCH_D20.A SCH_D21.A SCH_D22.A SCH_D23.A SCH_D27.A SCH_D28.A SCH_D29.A SCH_D30.A SCH_D35.A SCH_D36.A SCH_D37.A SCH_D38.A SCH_D40.A SCH_D42.A SCH_D44.A SCH_D46.A SCH_D48.A SCH_D50.A SCH_D52.A SCH_D54.A SCH_D56.A SCH_D58.A SCH_D60.A SCH_D62.A SCH_D63.A SCH_D64.A U1.2(GND) U17.5(2IN+) U18.3(ANODE) U19.5(2IN+) U20.3(ANODE) U21.5(2IN+) U22.3(ANODE) U23.5(2IN+) U24.3(ANODE) U25.5(2IN+) U26.3(ANODE) U27.5(2IN+) U28.3(ANODE) U29.5(2IN+) U30.3(ANODE) U31.5(2IN+) U32.3(ANODE) U44.5(2IN+) U45.3(ANODE) U46.5(2IN+) U47.3(ANODE) U48.5(2IN+) U49.3(ANODE) U50.5(2IN+) U51.3(ANODE) U52.5(2IN+) U53.3(ANODE) U54.5(2IN+) U55.3(ANODE) U56.5(2IN+) U57.3(ANODE) U58.5(2IN+) U59.3(ANODE) U60.5(2IN+) U61.3(ANODE) U62.5(2IN+) U63.3(ANODE)
I2C1_CLK: 510_R1.1 J8.08
I2C1_TX: 510_R76.1 J8.06
I2C2_CLK: 510_R77.1 J8.09
I2C2_TX: 510_R78.1 J8.10
N$2: 2K_R1.2 SCH_D1.C(K) SCH_D27.C(K)
N$5: 2K_R38.2 SCH_D24.C(K) SCH_D28.C(K)
N$8: 2K_R39.2 SCH_D25.C(K) SCH_D29.C(K)
N$11: 2K_R40.2 SCH_D26.C(K) SCH_D30.C(K)
N$14: 2K_R41.2 SCH_D31.C(K) SCH_D35.C(K)
N$15: 1NF_C5.1 2K_R2.2 10V_D2.2(A) U17.3(1IN+)
N$16: 10V_D2.1(K) 10V_D3.1(K)
N$17: 2K_R43.2 SCH_D33.C(K) SCH_D37.C(K)
N$18: 2K_R3.1 U17.1(1OUT) U17.2(1IN-)
N$20: 2K_R44.2 SCH_D34.C(K) SCH_D38.C(K)
N$23: 2K_R42.2 SCH_D32.C(K) SCH_D36.C(K)
N$29: 510_R10.1 510_R11.1 U17.9(3IN-)
N$30: 330_R2.2 510_R10.2 U17.7(2OUT)
N$31: 2K_R3.2 330_R2.1 U17.6(2IN-)
N$34: 32K_R10.1 100K_R10.2 U18.1(REF)
N$35: 10K_R5.2 32K_R14.2 510_R24.1 U26.2(CATHODE)
N$39: 1NF_C4.1 2K_R4.2 10V_D4.2(A) U19.3(1IN+)
N$40: 10V_D4.1(K) 10V_D5.1(K)
N$41: 2K_R5.1 U19.1(1OUT) U19.2(1IN-)
N$42: 330_R3.2 510_R13.2 U19.7(2OUT)
N$43: 2K_R5.2 330_R3.1 U19.6(2IN-)
N$44: 510_R13.1 510_R14.1 U19.9(3IN-)
N$47: 32K_R11.1 100K_R11.2 U20.1(REF)
N$48: 10K_R4.2 32K_R10.2 510_R12.1 U18.2(CATHODE)
N$52: 1NF_C3.1 2K_R6.2 10V_D6.2(A) U21.3(1IN+)
N$53: 10V_D6.1(K) 10V_D7.1(K)
N$54: 2K_R7.1 U21.1(1OUT) U21.2(1IN-)
N$55: 330_R4.2 510_R16.2 U21.7(2OUT)
N$56: 2K_R7.2 330_R4.1 U21.6(2IN-)
N$57: 510_R16.1 510_R17.1 U21.9(3IN-)
N$60: 32K_R12.1 100K_R12.2 U22.1(REF)
N$61: 10K_R3.2 32K_R11.2 510_R15.1 U20.2(CATHODE)
N$65: 1NF_C2.1 2K_R8.2 10V_D8.2(A) U23.3(1IN+)
N$66: 10V_D8.1(K) 10V_D9.1(K)
N$67: 2K_R9.1 U23.1(1OUT) U23.2(1IN-)
N$68: 330_R5.2 510_R19.2 U23.7(2OUT)
N$69: 2K_R9.2 330_R5.1 U23.6(2IN-)
N$70: 510_R19.1 510_R20.1 U23.9(3IN-)
N$73: 32K_R13.1 100K_R13.2 U24.1(REF)
N$74: 2K_R45.2 SCH_D39.C(K) SCH_D40.C(K)
N$78: 1NF_C6.1 2K_R10.2 10V_D10.2(A) U25.3(1IN+)
N$79: 10V_D10.1(K) 10V_D11.1(K)
N$80: 2K_R11.1 U25.1(1OUT) U25.2(1IN-)
N$81: 330_R6.2 510_R22.2 U25.7(2OUT)
N$82: 2K_R11.2 330_R6.1 U25.6(2IN-)
N$83: 510_R22.1 510_R23.1 U25.9(3IN-)
N$86: 32K_R14.1 100K_R14.2 U26.1(REF)
N$87: 10K_R6.2 32K_R15.2 510_R27.1 U28.2(CATHODE)
N$91: 1NF_C7.1 2K_R12.2 10V_D12.2(A) U27.3(1IN+)
N$92: 10V_D12.1(K) 10V_D13.1(K)
N$93: 2K_R13.1 U27.1(1OUT) U27.2(1IN-)
N$94: 330_R7.2 510_R25.2 U27.7(2OUT)
N$95: 2K_R13.2 330_R7.1 U27.6(2IN-)
N$96: 510_R25.1 510_R26.1 U27.9(3IN-)
N$99: 32K_R15.1 100K_R15.2 U28.1(REF)
N$100: 10K_R7.2 32K_R16.2 510_R30.1 U30.2(CATHODE)
N$102: 2K_R53.2 SCH_D55.C(K) SCH_D56.C(K)
N$103: 1NF_C13.1 2K_R18.2 10V_D18.2(A) U44.3(1IN+)
N$104: 1NF_C8.1 2K_R14.2 10V_D14.2(A) U29.3(1IN+)
N$105: 10V_D14.1(K) 10V_D15.1(K)
N$106: 2K_R15.1 U29.1(1OUT) U29.2(1IN-)
N$107: 330_R8.2 510_R28.2 U29.7(2OUT)
N$108: 2K_R15.2 330_R8.1 U29.6(2IN-)
N$109: 510_R28.1 510_R29.1 U29.9(3IN-)
N$111: 10V_D18.1(K) 10V_D19.1(K)
N$112: 32K_R16.1 100K_R16.2 U30.1(REF)
N$113: 10K_R8.2 32K_R17.2 510_R33.1 U32.2(CATHODE)
N$117: 1NF_C9.1 2K_R16.2 10V_D16.2(A) U31.3(1IN+)
N$118: 10V_D16.1(K) 10V_D17.1(K)
N$119: 2K_R17.1 U31.1(1OUT) U31.2(1IN-)
N$120: 330_R9.2 510_R31.2 U31.7(2OUT)
N$121: 2K_R17.2 330_R9.1 U31.6(2IN-)
N$122: 510_R31.1 510_R32.1 U31.9(3IN-)
N$124: 2K_R19.1 U44.1(1OUT) U44.2(1IN-)
N$125: 32K_R17.1 100K_R17.2 U32.1(REF)
N$126: 10K_R15.2 32K_R34.2 510_R64.1 U57.2(CATHODE)
N$128: 330_R10.2 510_R44.2 U44.7(2OUT)
N$129: 2K_R19.2 330_R10.1 U44.6(2IN-)
N$130: 510_R44.1 510_R45.1 U44.9(3IN-)
N$132: 32K_R28.1 100K_R28.2 U45.1(REF)
N$133: 10K_R13.1 30K_R13.1 U52.10(3IN+)
N$135: 1NF_C12.1 2K_R20.2 10V_D20.2(A) U46.3(1IN+)
N$136: 10V_D20.1(K) 10V_D21.1(K)
N$137: 2K_R21.1 U46.1(1OUT) U46.2(1IN-)
N$138: 330_R11.2 510_R47.2 U46.7(2OUT)
N$139: 2K_R21.2 330_R11.1 U46.6(2IN-)
N$140: 510_R47.1 510_R48.1 U46.9(3IN-)
N$142: 32K_R29.1 100K_R29.2 U47.1(REF)
N$143: 10K_R12.1 30K_R12.1 U44.10(3IN+)
N$145: 1NF_C11.1 2K_R22.2 10V_D22.2(A) U48.3(1IN+)
N$146: 10V_D22.1(K) 10V_D23.1(K)
N$147: 2K_R23.1 U48.1(1OUT) U48.2(1IN-)
N$148: 330_R12.2 510_R50.2 U48.7(2OUT)
N$149: 2K_R23.2 330_R12.1 U48.6(2IN-)
N$150: 510_R50.1 510_R51.1 U48.9(3IN-)
N$152: 32K_R30.1 100K_R30.2 U49.1(REF)
N$153: 10K_R11.1 30K_R11.1 U46.10(3IN+)
N$155: 1NF_C10.1 2K_R24.2 10V_D24.2(A) U50.3(1IN+)
N$156: 10V_D24.1(K) 10V_D25.1(K)
N$157: 2K_R25.1 U50.1(1OUT) U50.2(1IN-)
N$158: 330_R13.2 510_R53.2 U50.7(2OUT)
N$159: 2K_R25.2 330_R13.1 U50.6(2IN-)
N$160: 510_R53.1 510_R54.1 U50.9(3IN-)
N$162: 32K_R31.1 100K_R31.2 U51.1(REF)
N$163: 10K_R10.1 30K_R10.1 U48.10(3IN+)
N$164: 10K_R9.1 30K_R9.1 U50.10(3IN+)
N$165: 1NF_C14.1 2K_R26.2 10V_D26.2(A) U52.3(1IN+)
N$166: 10V_D26.1(K) 10V_D27.1(K)
N$167: 2K_R27.1 U52.1(1OUT) U52.2(1IN-)
N$168: 330_R14.2 510_R56.2 U52.7(2OUT)
N$169: 2K_R27.2 330_R14.1 U52.6(2IN-)
N$170: 510_R56.1 510_R57.1 U52.9(3IN-)
N$172: 32K_R32.1 100K_R32.2 U53.1(REF)
N$173: 10K_R14.1 30K_R14.1 U54.10(3IN+)
N$175: 1NF_C15.1 2K_R28.2 10V_D28.2(A) U54.3(1IN+)
N$176: 10V_D28.1(K) 10V_D29.1(K)
N$177: 2K_R29.1 U54.1(1OUT) U54.2(1IN-)
N$178: 330_R15.2 510_R59.2 U54.7(2OUT)
N$179: 2K_R29.2 330_R15.1 U54.6(2IN-)
N$180: 510_R59.1 510_R60.1 U54.9(3IN-)
N$182: 32K_R33.1 100K_R33.2 U55.1(REF)
N$183: 2K_R46.2 SCH_D41.C(K) SCH_D42.C(K)
N$185: 1NF_C16.1 2K_R30.2 10V_D30.2(A) U56.3(1IN+)
N$186: 10V_D30.1(K) 10V_D31.1(K)
N$187: 2K_R31.1 U56.1(1OUT) U56.2(1IN-)
N$188: 330_R16.2 510_R62.2 U56.7(2OUT)
N$189: 2K_R31.2 330_R16.1 U56.6(2IN-)
N$190: 510_R62.1 510_R63.1 U56.9(3IN-)
N$192: 32K_R34.1 100K_R34.2 U57.1(REF)
N$193: 10K_R16.1 30K_R16.1 U58.10(3IN+)
N$195: 1NF_C17.1 2K_R32.2 10V_D32.2(A) U58.3(1IN+)
N$196: 10V_D32.1(K) 10V_D33.1(K)
N$197: 2K_R33.1 U58.1(1OUT) U58.2(1IN-)
N$198: 330_R17.2 510_R65.2 U58.7(2OUT)
N$199: 2K_R33.2 330_R17.1 U58.6(2IN-)
N$200: 510_R65.1 510_R66.1 U58.9(3IN-)
N$202: 32K_R35.1 100K_R35.2 U59.1(REF)
N$203: 10K_R17.1 30K_R17.1 U60.10(3IN+)
N$205: 1NF_C18.1 2K_R34.2 10V_D34.2(A) U60.3(1IN+)
N$206: 10V_D34.1(K) 10V_D35.1(K)
N$207: 2K_R35.1 U60.1(1OUT) U60.2(1IN-)
N$208: 330_R18.2 510_R68.2 U60.7(2OUT)
N$209: 2K_R35.2 330_R18.1 U60.6(2IN-)
N$210: 510_R68.1 510_R69.1 U60.9(3IN-)
N$212: 32K_R36.1 100K_R36.2 U61.1(REF)
N$213: 10K_R18.1 30K_R18.1 U62.10(3IN+)
N$215: 1NF_C19.1 2K_R36.2 10V_D36.2(A) U62.3(1IN+)
N$216: 10V_D36.1(K) 10V_D37.1(K)
N$217: 2K_R37.1 U62.1(1OUT) U62.2(1IN-)
N$218: 330_R19.2 510_R71.2 U62.7(2OUT)
N$219: 2K_R37.2 330_R19.1 U62.6(2IN-)
N$220: 510_R71.1 510_R72.1 U62.9(3IN-)
N$222: 32K_R37.1 100K_R37.2 U63.1(REF)
N$239: 10K_R1.2 32K_R13.2 510_R21.1 U24.2(CATHODE)
N$242: 10K_R1.1 30K_R1.1 U23.10(3IN+)
N$243: 10K_R9.2 32K_R31.2 510_R55.1 U51.2(CATHODE)
N$244: 10K_R2.1 30K_R2.1 U21.10(3IN+)
N$245: 10K_R2.2 32K_R12.2 510_R18.1 U22.2(CATHODE)
N$246: 10K_R3.1 30K_R3.1 U19.10(3IN+)
N$247: 10K_R4.1 30K_R4.1 U17.10(3IN+)
N$248: 10K_R5.1 30K_R5.1 U25.10(3IN+)
N$249: 10K_R6.1 30K_R6.1 U27.10(3IN+)
N$250: 10K_R7.1 30K_R7.1 U29.10(3IN+)
N$251: 10K_R8.1 30K_R8.1 U31.10(3IN+)
N$252: 10K_R10.2 32K_R30.2 510_R52.1 U49.2(CATHODE)
N$253: 10K_R11.2 32K_R29.2 510_R49.1 U47.2(CATHODE)
N$254: 10K_R12.2 32K_R28.2 510_R46.1 U45.2(CATHODE)
N$255: 10K_R13.2 32K_R32.2 510_R58.1 U53.2(CATHODE)
N$256: 10K_R14.2 32K_R33.2 510_R61.1 U55.2(CATHODE)
N$257: 10K_R15.1 30K_R15.1 U56.10(3IN+)
N$258: 10K_R16.2 32K_R35.2 510_R67.1 U59.2(CATHODE)
N$259: 10K_R17.2 32K_R36.2 510_R70.1 U61.2(CATHODE)
N$260: 10K_R18.2 32K_R37.2 510_R73.1 U63.2(CATHODE)
N$261: 2K_R47.2 SCH_D43.C(K) SCH_D44.C(K)
N$262: 2K_R54.2 SCH_D57.C(K) SCH_D58.C(K)
N$263: 2K_R48.2 SCH_D45.C(K) SCH_D46.C(K)
N$265: 2K_R49.2 SCH_D47.C(K) SCH_D48.C(K)
N$266: 2K_R55.2 SCH_D59.C(K) SCH_D60.C(K)
N$267: 2K_R50.2 SCH_D49.C(K) SCH_D50.C(K)
N$269: 2K_R51.2 SCH_D51.C(K) SCH_D52.C(K)
N$270: 2K_R56.2 SCH_D61.C(K) SCH_D62.C(K)
N$271: 2K_R52.2 SCH_D53.C(K) SCH_D54.C(K)
NC1: J3.63
NC2: J3.57
NC3: J3.51
NC4: J3.43
NC5: J3.41
NC6: J3.25
NC7: J3.09
NC8: J3.68
NC9: J3.60
NC10: J3.54
NC11: J3.52
NC12: J1.70
NC13: J1.60
NC14: J1.58
NC15: J1.67
NC16: J1.57
NC17: J1.37
NC18: J1.35
NRST: J3.13
OSCI: J3.30
OSCO: J3.32
PA0: J3.27
PA1: J3.29
PA2: J1.36
PA3: 3.3V_D24.C(K) 510_R72.2 J1.38 U43.6(2IN-) U43.7(2OUT) U62.8(3OUT)
PA4: J3.31 U64.10(3IN+)
PA5: J1.12 U64.12(4IN+)
PA6: 3.3V_D9.C(K) 510_R54.2 J1.14 U5.1(1OUT) U5.2(1IN-) U50.8(3OUT)
PA7: J1.16
PA8: J1.24
PA9: J1.22
PA10: J1.34 U15.5(2IN+) U19.12(4IN+)
PA11: J1.13
PA12: J1.11
PA13: J3.14
PA14: J3.16
PA15: J3.18
PB0: J3.33
PB1: J1.23
PB2: J1.21
PB3: J1.32 U64.5(2IN+)
PB4: J1.28
PB5: J1.30
PB6: 3.3V_D20.C(K) 510_R1.2 J1.18 SCH_D22.C(K)
PB7: 3.3V_D21.C(K) 510_R76.2 J3.22 SCH_D23.C(K)
PB8: 3.3V_D22.C(K) 510_R77.2 J1.04 SCH_D63.C(K)
PB9: 3.3V_D23.C(K) 510_R78.2 J1.06 SCH_D64.C(K)
PB10: J1.26
PB11: J1.17
PB12: J1.15
PB13: J1.29
PB14: 3.3V_D19.C(K) J1.27 U67.6(2IN-) U67.7(2OUT)
PB15: J1.25 U15.3(1IN+) U17.12(4IN+)
PC0: 3.3V_D16.C(K) 510_R66.2 J3.37 U6.13(4IN-) U6.14(4OUT) U58.8(3OUT)
PC1: J3.35
PC2: J3.36
PC3: J3.38
PC4: J1.33
PC5: J1.05
PC6: J1.03 U64.3(1IN+)
PC7: J1.20
PC8: J1.01
PC9: J1.02
PC10: J3.02
PC11: J3.01
PC12: J3.04
PC13: J3.24
PC14: J3.26
PC15: J3.28
PD0: J3.58
PD1: J3.56
PD2: J3.03
PD3: J3.39
PD4: J3.40
PD5: J3.42
PD6: J3.44
PD7: J3.46
PD8: J1.09
PD9: J3.70
PD10: J1.66
PD11: J1.46 U16.3(1IN+) U31.12(4IN+)
PD12: 3.3V_D2.C(K) 510_R17.2 J1.44 U2.6(2IN-) U2.7(2OUT) U21.8(3OUT)
PD13: 3.3V_D3.C(K) 510_R14.2 J1.42 U2.8(3OUT) U2.9(3IN-) U19.8(3OUT)
PD14: J1.45 U15.10(3IN+) U21.12(4IN+)
PD15: 3.3V_D1.C(K) 510_R20.2 J1.47 U2.1(1OUT) U2.2(1IN-) U23.8(3OUT)
PE0: J1.63
PE1: 3.3V_D18.C(K) J3.62 U67.1(1OUT) U67.2(1IN-)
PE2: J3.45
PE3: J3.48
PE4: J3.47
PE5: J3.49
PE6: J3.61
PE7: J1.43 U16.12(4IN+) U25.12(4IN+)
PE8: J1.39 U16.10(3IN+) U27.12(4IN+)
PE9: J1.51 U15.12(4IN+) U23.12(4IN+)
PE10: J1.48
PE11: J1.55
PE12: 3.3V_D5.C(K) 510_R23.2 J1.50 U3.1(1OUT) U3.2(1IN-) U25.8(3OUT)
PE13: 3.3V_D6.C(K) 510_R26.2 J1.56 U3.6(2IN-) U3.7(2OUT) U27.8(3OUT)
PE14: 3.3V_D8.C(K) 510_R29.2 J1.52 U3.8(3OUT) U3.9(3IN-) U29.8(3OUT)
PE15: 3.3V_D7.C(K) 510_R32.2 J1.54 U3.13(4IN-) U3.14(4OUT) U31.8(3OUT)
PF6: 3.3V_D11.C(K) 510_R48.2 J3.10 U5.8(3OUT) U5.9(3IN-) U46.8(3OUT)
PF7: 3.3V_D12.C(K) 510_R45.2 J3.12 U5.13(4IN-) U5.14(4OUT) U44.8(3OUT)
PF8: 3.3V_D13.C(K) 510_R57.2 J3.53 U6.1(1OUT) U6.2(1IN-) U52.8(3OUT)
PF9: 3.3V_D14.C(K) 510_R60.2 J3.55 U6.6(2IN-) U6.7(2OUT) U54.8(3OUT)
PF10: 3.3V_D15.C(K) 510_R63.2 J1.41 U6.8(3OUT) U6.9(3IN-) U56.8(3OUT)
PF11: 3.3V_D10.C(K) 510_R51.2 J1.61 U5.6(2IN-) U5.7(2OUT) U48.8(3OUT)
PF14: 3.3V_D17.C(K) 510_R69.2 J1.49 U43.1(1OUT) U43.2(1IN-) U60.8(3OUT)
PF15: 3.3V_D4.C(K) 510_R11.2 J1.59 U2.13(4IN-) U2.14(4OUT) U17.8(3OUT)
PG6: J1.69 U16.5(2IN+) U29.12(4IN+)
PG7: J1.68
PG8: J1.65
PG9: J3.64
PG10: J3.65
PG11: J3.69
PG12: J3.66
PG13: J3.67
PG14: J1.62
PWM_1: 2K_R55.1 J8.01
PWM_1_T: SCH_D61.A U64.1(1OUT) U64.2(1IN-)
PWM_2: 2K_R56.1 J8.03
PWM_2_T: SCH_D59.A U64.6(2IN-) U64.7(2OUT)
U5V: J1.07
VBAT: J3.34
VDD: J3.06
VIN: J3.23 U1.3(OUT)
VREF: J1.08
Unconnected: J4.09 J4.10 J4.11 J5.09 J5.10 J5.11 J6.11 J7.11 J8.11 U43.8(3OUT) U43.9(3IN-) U43.10(3IN+) U43.12(4IN+) U43.13(4IN-) U43.14(4OUT) U44.12(4IN+) U44.13(4IN-) U44.14(4OUT) U46.12(4IN+) U46.13(4IN-) U46.14(4OUT) U48.12(4IN+) U48.13(4IN-) U48.14(4OUT) U50.12(4IN+) U50.13(4IN-) U50.14(4OUT) U52.12(4IN+) U52.13(4IN-) U52.14(4OUT) U54.12(4IN+) U54.13(4IN-) U54.14(4OUT) U56.12(4IN+) U56.13(4IN-) U56.14(4OUT) U58.12(4IN+) U58.13(4IN-) U58.14(4OUT) U60.12(4IN+) U60.13(4IN-) U60.14(4OUT) U62.12(4IN+) U62.13(4IN-) U62.14(4OUT) U67.8(3OUT) U67.9(3IN-) U67.10(3IN+) U67.12(4IN+) U67.13(4IN-) U67.14(4OUT)

## Notes on the sheet
- 10V DIO
- 0-3.3V Digital I/O x8
- Check If Reverse Direction is a Problem
- 10V AI
- 3.3V Analog Input

## Library data of the parts
1NF_C2-1NF_C19 = GRM1885C1H102JA01D:GRM1885C1H102JA01D
2K_R1-2K_R56 = RC2512FK-072KL:RC2512FK-072KL
3.3V_D1-3.3V_D24 = BZT52B3V3_RHG:BZT52B3V3_RHG; MANUFACTURER: Taiwan Semiconductor; MAXIMUM_PACKAGE_HEIGHT: 1.15 mm; PARTREV: F15; STANDARD: Manufacturer Recommendations
4.3NF_C2-4.3NF_C21 = GRM1885C1H432JA01D:GRM1885C1H432JA01D
10K_R1-10K_R18 = RCS080510K0FKEA:RCS080510K0FKEA
10V_D1-10V_D56 = SMAZ10-13-F:SMAZ10-13-F; MANUFACTURER: Diodes Inc.; MAXIMUM_PACKAGE_HEIGHT: 2.4mm; PARTREV: 19 - 2; STANDARD: IPC-7351B
30K_R1-30K_R18 = RMCF0805FT30K0:RMCF0805FT30K0
32K_R10-32K_R17 32K_R28-32K_R37 = RNCF0603BTE32K0:RNCF0603BTE32K0
100K_R10-100K_R17 100K_R28-100K_R37 = RC0805FR-07100KL:RC0805FR-07100KL
330_R2-330_R19 = RC1206FR-07330RL:RC1206FR-07330RL
510_R1-510_R78 = RMCF2512FT510R:RMCF2512FT510R
J1 J3 = SSM-135-L-DV:SSM-135-L-DV; MANUFACTURER: Samtec; PARTREV: R; STANDARD: Manufacturer Recommendations
J4-J8 = 89898-306ALF:89898-306ALF; MANUFACTURER: Amphenol ICC (FCI); PARTREV: AK; STANDARD: Manufacturer Recommendations
SCH_D1-SCH_D64 = B140-13-F:B140-13-F; MANUFACTURER: Diodes Inc.; MAXIMUM_PACKAGE_HEIGHT: 2.4 mm; PARTREV: 19 - 2; STANDARD: IPC 7351B
U1 = L78M08CDT-TR:L78M08CDT-TR; MANUFACTURER: STMicroelectronics; MAXIMUM_PACKAGE_HEIGHT: 2.4 mm; PARTREV: 23; STANDARD: Manufacturer Recommendations
U2 U3 U5 U6 U15-U17 U19 U21 U23 U25 U27 U29 U31 U43 U44 U46 U48 U50 U52 U54 U56 U58 U60 U62 U64 U67 = TL074IN:TL074IN
U18 U20 U22 U24 U26 U28 U30 U32 U45 U47 U49 U51 U53 U55 U57 U59 U61 U63 = TL431AIDBZR:TL431AIDBZR; MPN: TL431AIDBZR; OC_FARNELL: 1764815; OC_NEWARK: 44J2402; PACKAGE: SOT23-3; SUPPLIER: Texas Instruments